# EAGLE schematic RASPILOTv1_0 (EAGLE 7.2.0)

## Sheet 1 of 8
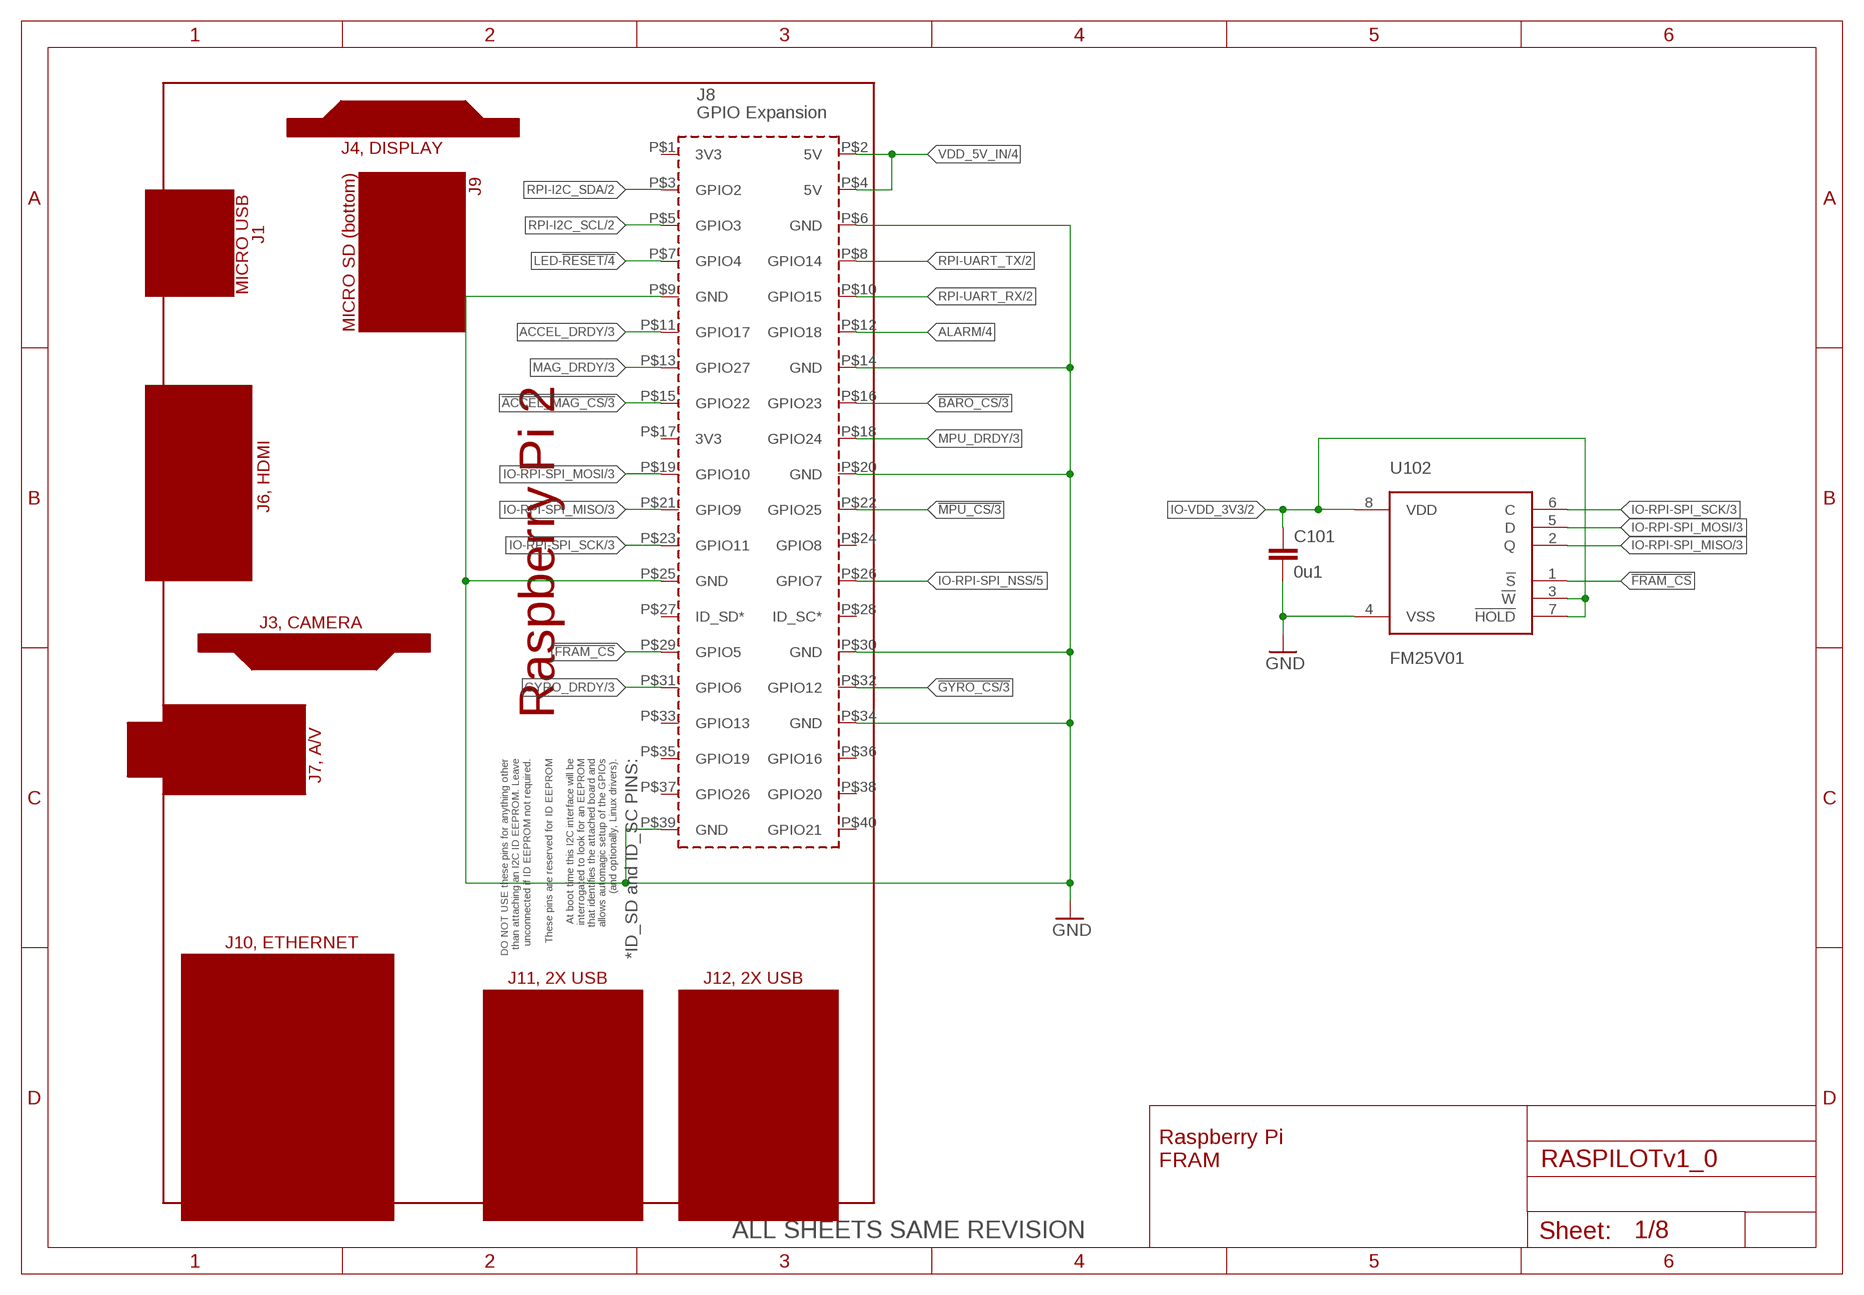
[diagram p0: schematic, sheet 1]

### Parts
C101  0u1  CAP0402  [0402-CAP]
U101  RPI2  [RPI2]
U102  FM25V01  [SO08]

### Nets
!ACCEL_MAG_CS: U101.P$15(GPIO22) ; also sheet 3
!BARO_CS: U101.P$16(GPIO23) ; also sheet 3
!FRAM_CS: U101.P$29(GPIO5) U102.1(!S)
!GYRO_CS: U101.P$32(GPIO12) ; also sheet 3
!MPU_CS: U101.P$22(GPIO25) ; also sheet 3
ACCEL_DRDY: U101.P$11(GPIO17) ; also sheet 3
ALARM: U101.P$12(GPIO18) ; also sheet 4
GND [power]: C101.P$2 U101.P$6(GND) U101.P$9(GND) U101.P$14(GND) U101.P$20(GND) U101.P$25(GND) U101.P$30(GND) U101.P$34(GND) U101.P$39(GND) U102.4(VSS) ; also sheet 2,3,4,5,6,7,8
GYRO_DRDY: U101.P$31(GPIO6) ; also sheet 3
IO-RPI-SPI_MISO: U101.P$21(GPIO9) U102.2(Q) ; also sheet 3,5
IO-RPI-SPI_MOSI: U101.P$19(GPIO10) U102.5(D) ; also sheet 3,5
IO-RPI-SPI_NSS: U101.P$26(GPIO7) ; also sheet 5
IO-RPI-SPI_SCK: U101.P$23(GPIO11) U102.6(C) ; also sheet 3,5
IO-VDD_3V3 [power]: C101.P$1 U102.3(!W) U102.7(!HOLD) U102.8(VDD) ; also sheet 2,4,5,6,7
LED-!RESET: U101.P$7(GPIO4) ; also sheet 4
MAG_DRDY: U101.P$13(GPIO27) ; also sheet 3
MPU_DRDY [power]: U101.P$18(GPIO24) ; also sheet 3
RPI-I2C_SCL: U101.P$5(GPIO3) ; also sheet 2,4
RPI-I2C_SDA: U101.P$3(GPIO2) ; also sheet 2,4
RPI-UART_RX: U101.P$10(GPIO15) ; also sheet 2
RPI-UART_TX: U101.P$8(GPIO14) ; also sheet 2
VDD_5V_IN [power]: U101.P$2(5V) U101.P$4(5V) ; also sheet 4,7,8
Unconnected: U101.P$1(3V3) U101.P$17(3V3) U101.P$24(GPIO8) U101.P$27(ID_SD*) U101.P$28(ID_SC*) U101.P$33(GPIO13) U101.P$35(GPIO19) U101.P$36(GPIO16) U101.P$37(GPIO26) U101.P$38(GPIO20) U101.P$40(GPIO21)

### Notes on the sheet
- Raspberry Pi
  FRAM
- ALL SHEETS SAME REVISION

## Sheet 2 of 8
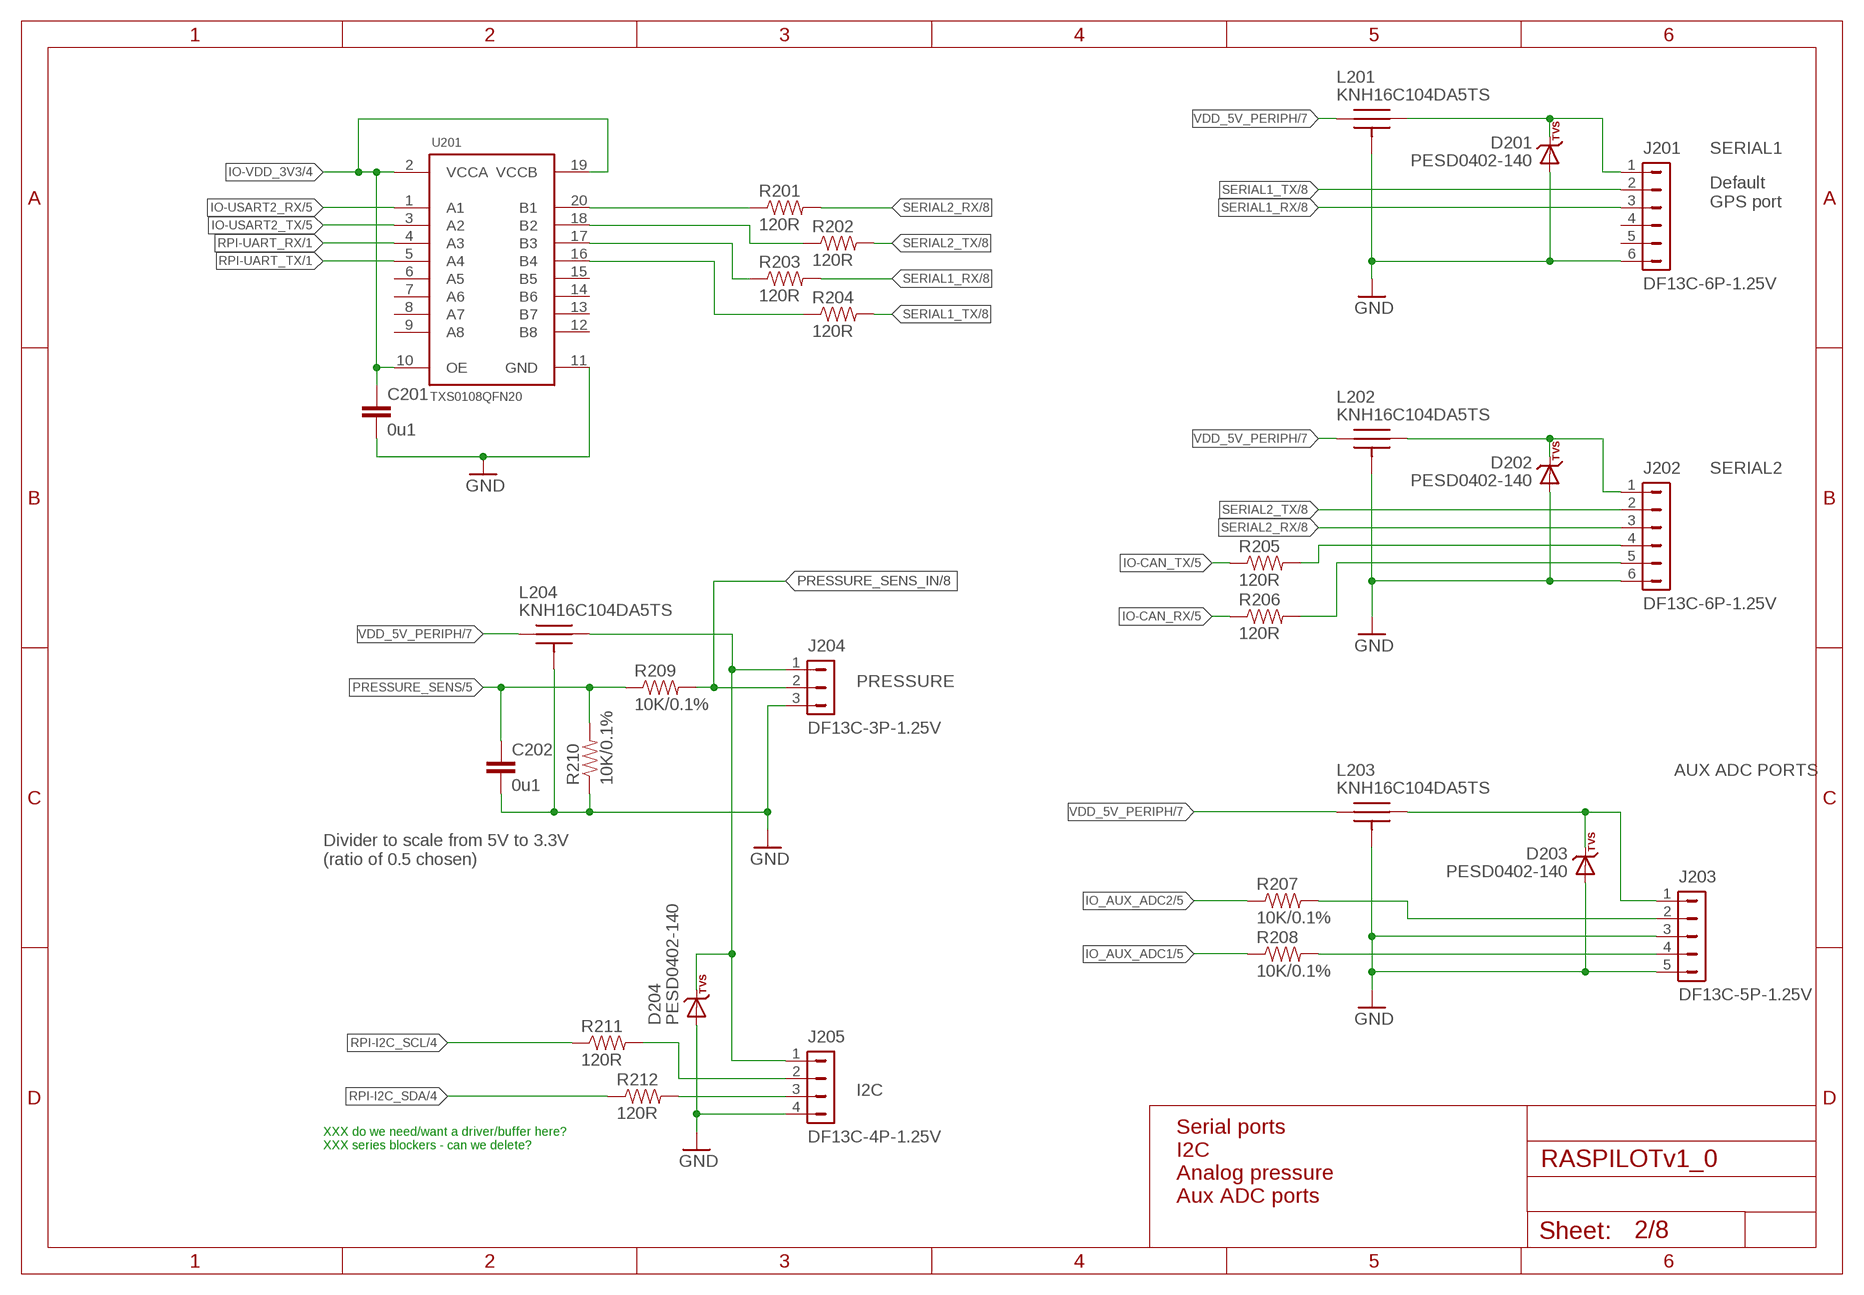
[diagram p1: schematic, sheet 2]

### Parts
C201  0u1  CAP0402  [0402-CAP]
C202  0u1  CAP0402  [0402-CAP]
D201  PESD0402-140  DIODE-TVS  [0402-TVS]
D202  PESD0402-140  DIODE-TVS  [0402-TVS]
D203  PESD0402-140  DIODE-TVS  [0402-TVS]
D204  PESD0402-140  DIODE-TVS  [0402-TVS]
J201  DF13C-6P-1.25V  DF13-6P-1.25V  [DF13C-6P-1.25V]
J202  DF13C-6P-1.25V  DF13-6P-1.25V  [DF13C-6P-1.25V]
J203  DF13C-5P-1.25V  DF13-5P-1.25V  [DF13C-5P-1.25V]
J204  DF13C-3P-1.25V  DF13-3P-1.25V  [DF13C-3P-1.25V]
J205  DF13C-4P-1.25V  DF13-4P-1.25V  [DF13C-4P-1.25V]
L201  KNH16C104DA5TS  [KYOCERA-KNH16-DA]
L202  KNH16C104DA5TS  [KYOCERA-KNH16-DA]
L203  KNH16C104DA5TS  [KYOCERA-KNH16-DA]
L204  KNH16C104DA5TS  [KYOCERA-KNH16-DA]
R201  120R  RESISTOR0402-RES  [0402-RES]
R202  120R  RESISTOR0402-RES  [0402-RES]
R203  120R  RESISTOR0402-RES  [0402-RES]
R204  120R  RESISTOR0402-RES  [0402-RES]
R205  120R  RESISTOR0402-RES  [0402-RES]
R206  120R  RESISTOR0402-RES  [0402-RES]
R207  10K/0.1%  RESISTOR0402-RES  [0402-RES]
R208  10K/0.1%  RESISTOR0402-RES  [0402-RES]
R209  10K/0.1%  RESISTOR0402-RES  [0402-RES]
R210  10K/0.1%  RESISTOR0402-RES  [0402-RES]
R211  120R  RESISTOR0402-RES  [0402-RES]
R212  120R  RESISTOR0402-RES  [0402-RES]
U201  TXS0108QFN20  [QFN20-RGY]

### Nets
FMU_AUX_ADC1_PROT1: J203.4 R208.P$2
FMU_AUX_ADC2_PROT1: J203.2 R207.P$2
GND [power]: C201.P$2 C202.P$2 D201.A D202.A D203.A D204.A J201.6 J202.6 J203.3 J203.5 J204.3 J205.4 L201.P$3 L201.P$4 L201.P$5 L202.P$3 L202.P$4 L202.P$5 L203.P$3 L203.P$4 L203.P$5 L204.P$3 L204.P$4 L204.P$5 R210.P$1 U201.11(GND) ; also sheet 1,3,4,5,6,7,8
IO-CAN_RX: R206.P$1 ; also sheet 5,8
IO-CAN_TX: R205.P$1 ; also sheet 5,8
IO-USART2_RX: U201.1(A1) ; also sheet 5
IO-USART2_TX: U201.3(A2) ; also sheet 5
IO-VDD_3V3 [power]: C201.P$1 U201.2(VCCA) U201.10(OE) U201.19(VCCB) ; also sheet 1,4,5,6,7
IO_AUX_ADC1: R208.P$1 ; also sheet 5
IO_AUX_ADC2: R207.P$1 ; also sheet 5
N$4 [power]: D203.C J203.1 L203.P$2
N$5 [power]: D201.C J201.1 L201.P$2
N$7: J205.2 R211.P$2
N$8: J205.3 R212.P$2
N$11 [power]: D204.C J204.1 J205.1 L204.P$2
N$14: J202.4 R205.P$2
N$19: J202.5 R206.P$2
N$70: R201.P$1 U201.20(B1)
N$82: R202.P$1 U201.18(B2)
N$83: R203.P$1 U201.17(B3)
N$84: R204.P$1 U201.16(B4)
N$100 [power]: D202.C J202.1 L202.P$2
PRESSURE_SENS: C202.P$1 R209.P$1 R210.P$2 ; also sheet 5
PRESSURE_SENS_IN: J204.2 R209.P$2 ; also sheet 8
RPI-I2C_SCL: R211.P$1 ; also sheet 1,4
RPI-I2C_SDA: R212.P$1 ; also sheet 1,4
RPI-UART_RX: U201.4(A3) ; also sheet 1
RPI-UART_TX: U201.5(A4) ; also sheet 1
SERIAL1_RX: J201.3 R203.P$2 ; also sheet 8
SERIAL1_TX: J201.2 R204.P$2 ; also sheet 8
SERIAL2_RX: J202.3 R201.P$2 ; also sheet 8
SERIAL2_TX: J202.2 R202.P$2 ; also sheet 8
VDD_5V_PERIPH [power]: L201.P$1 L202.P$1 L203.P$1 L204.P$1 ; also sheet 7
Unconnected: J201.4 J201.5 U201.6(A5) U201.7(A6) U201.8(A7) U201.9(A8) U201.12(B8) U201.13(B7) U201.14(B6) U201.15(B5)

### Notes on the sheet
- SERIAL1
- Default 
  GPS port
- SERIAL2
- PRESSURE
- AUX ADC PORTS
- Divider to scale from 5V to 3.3V
  (ratio of 0.5 chosen)
- I2C
- XXX do we need/want a driver/buffer here?
  XXX series blockers - can we delete?
- Serial ports
  I2C
  Analog pressure
  Aux ADC ports

## Sheet 3 of 8
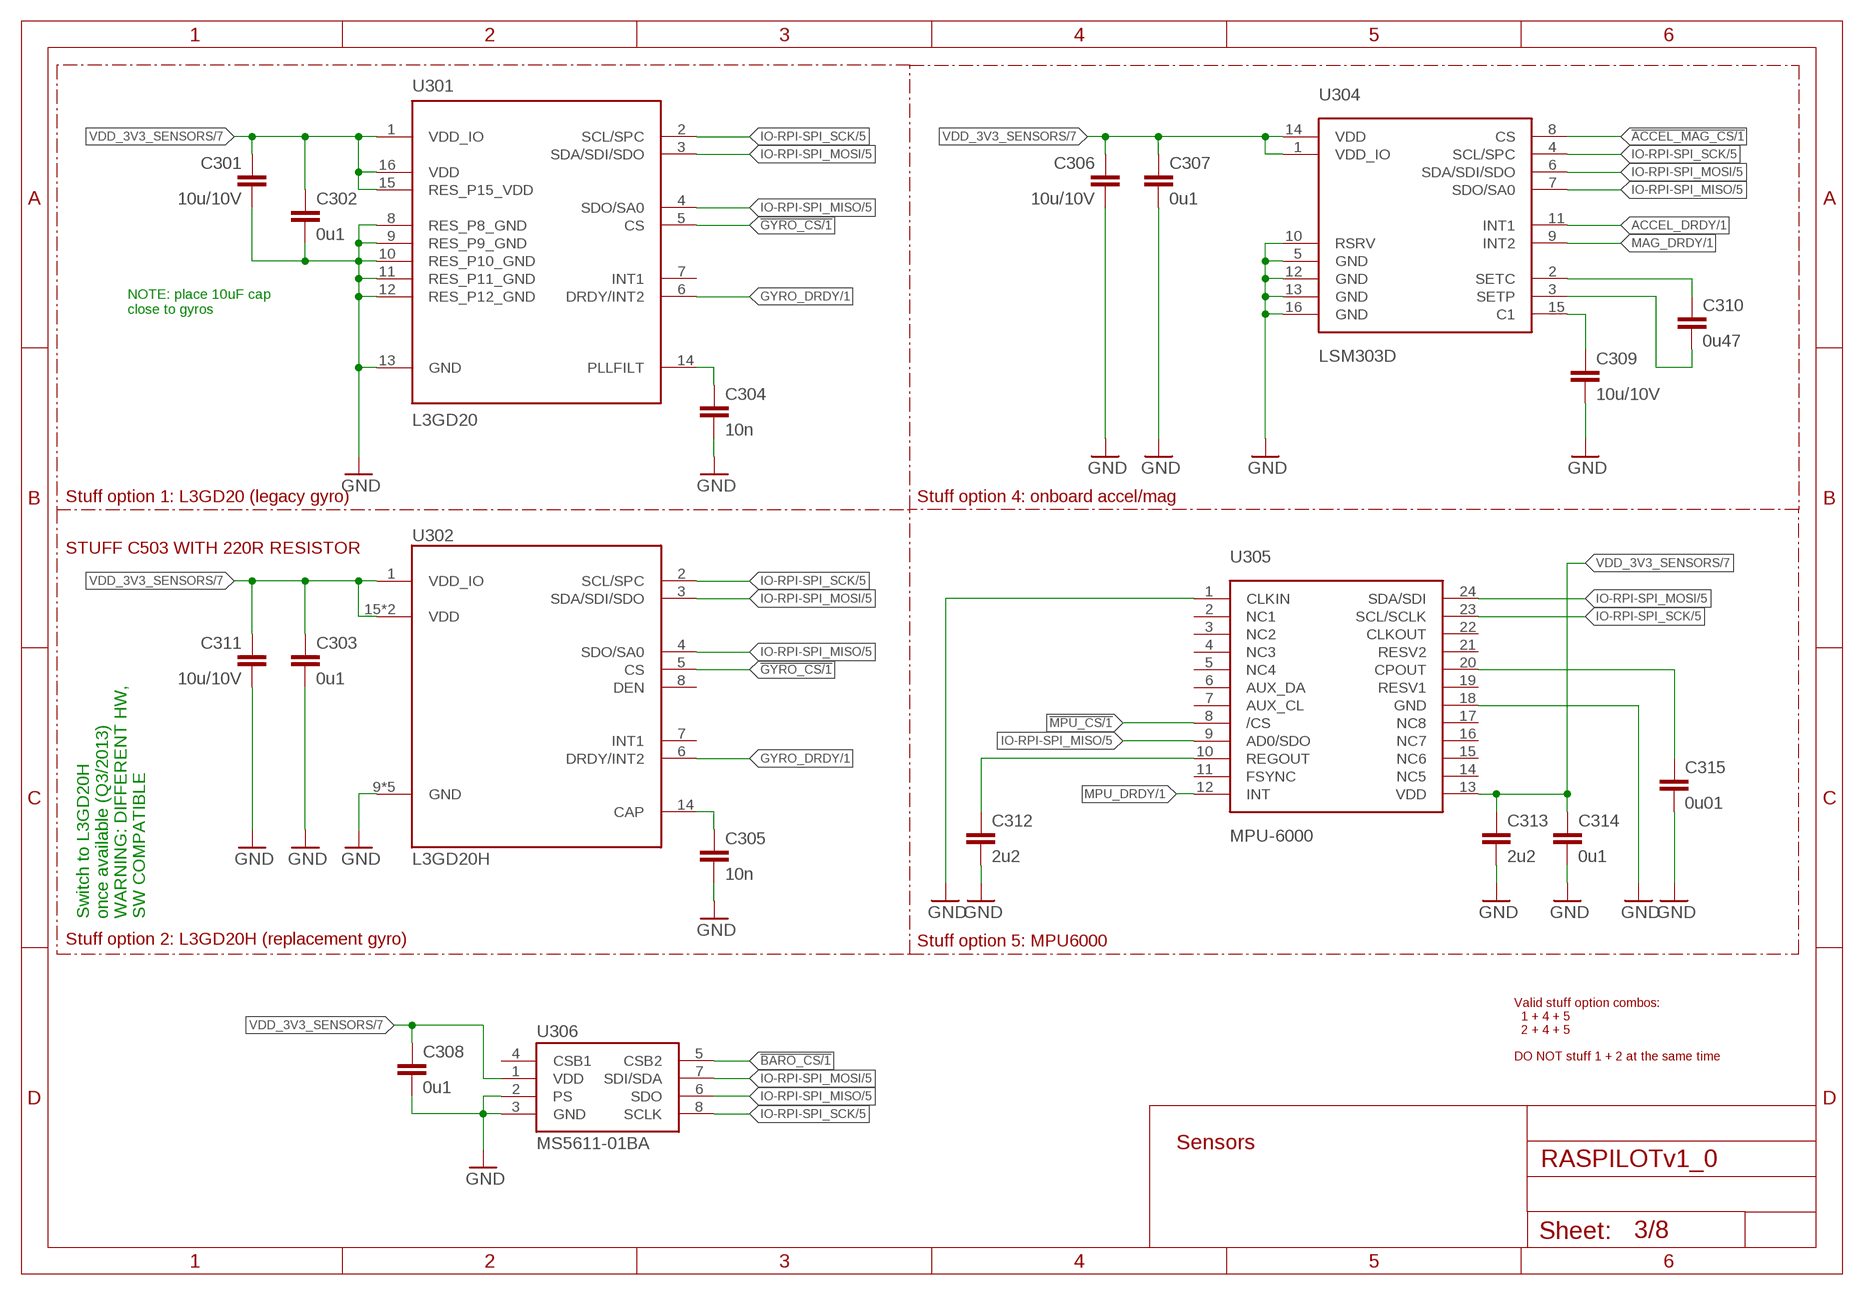
[diagram p2: schematic, sheet 3]

### Parts
C301  10u/10V  CAP0805  [0805-CAP]
C302  0u1  CAP0402  [0402-CAP]
C303  0u1  CAP0402  [0402-CAP]
C304  10n  CAP0402  [0402-CAP]
C305  10n  CAP0402  [0402-CAP]
C306  10u/10V  CAP0805  [0805-CAP]
C307  0u1  CAP0402  [0402-CAP]
C308  0u1  CAP0402  [0402-CAP]
C309  10u/10V  CAP0805  [0805-CAP]
C310  0u47  CAP0402  [0402-CAP]
C311  10u/10V  CAP0805  [0805-CAP]
C312  2u2  CAP0603  [0603-CAP]
C313  2u2  CAP0603  [0603-CAP]
C314  0u1  CAP0402  [0402-CAP]
C315  0u01  CAP0603  [0603-CAP]
U301  L3GD20  L3G4200DH-LL  [L3G4200DH-MAN]
U302  L3GD20H  [LGA-16L]
U304  LSM303D  [LGA-16L]
U305  MPU-6000  [QFN-24]
U306  MS5611-01BA  [MS5611-01BA]

### Nets
!ACCEL_MAG_CS: U304.8(CS) ; also sheet 1
!BARO_CS: U306.5(CSB2) ; also sheet 1
!GYRO_CS: U301.5(CS) U302.5(CS) ; also sheet 1
!MPU_CS: U305.8(/CS) ; also sheet 1
ACCEL_DRDY: U304.11(INT1) ; also sheet 1
GND [power]: C301.P$2 C302.P$2 C303.P$2 C304.P$2 C305.P$2 C306.P$2 C307.P$2 C308.P$2 C309.P$2 C311.P$2 C312.P$2 C313.P$2 C314.P$2 C315.P$2 U301.8(RES_P8_GND) U301.9(RES_P9_GND) U301.10(RES_P10_GND) U301.11(RES_P11_GND) U301.12(RES_P12_GND) U301.13(GND) U302.9(GND) U302.10(GND) U302.11(GND) U302.12(GND) U302.13(GND) U304.5(GND) U304.10(RSRV) U304.12(GND) U304.13(GND) U304.16(GND) U305.1(CLKIN) U305.18(GND) U306.2(PS) U306.3(GND) ; also sheet 1,2,4,5,6,7,8
GYRO_DRDY: U301.6(DRDY/INT2) U302.6(DRDY/INT2) ; also sheet 1
IO-RPI-SPI_MISO: U301.4(SDO/SA0) U302.4(SDO/SA0) U304.7(SDO/SA0) U305.9(AD0/SDO) U306.6(SDO) ; also sheet 1,5
IO-RPI-SPI_MOSI: U301.3(SDA/SDI/SDO) U302.3(SDA/SDI/SDO) U304.6(SDA/SDI/SDO) U305.24(SDA/SDI) U306.7(SDI/SDA) ; also sheet 1,5
IO-RPI-SPI_SCK: U301.2(SCL/SPC) U302.2(SCL/SPC) U304.4(SCL/SPC) U305.23(SCL/SCLK) U306.8(SCLK) ; also sheet 1,5
MAG_DRDY: U304.9(INT2) ; also sheet 1
MPU_DRDY [power]: U305.12(INT) ; also sheet 1
N$6: C309.P$1 U304.15(C1)
N$10: C310.P$1 U304.2(SETC)
N$17: C310.P$2 U304.3(SETP)
N$30: C305.P$1 U302.14(CAP)
N$35: C304.P$1 U301.14(PLLFILT)
N$50: C312.P$1 U305.10(REGOUT)
N$51: C315.P$1 U305.20(CPOUT)
VDD_3V3_SENSORS [power]: C301.P$1 C302.P$1 C303.P$1 C306.P$1 C307.P$1 C308.P$1 C311.P$1 C313.P$1 C314.P$1 U301.1(VDD_IO) U301.15(RES_P15_VDD) U301.16(VDD) U302.1(VDD_IO) U302.15(VDD) U302.16(VDD) U304.1(VDD_IO) U304.14(VDD) U305.13(VDD) U306.1(VDD) ; also sheet 7
Unconnected: U301.7(INT1) U302.7(INT1) U302.8(DEN) U305.2(NC1) U305.3(NC2) U305.4(NC3) U305.5(NC4) U305.6(AUX_DA) U305.7(AUX_CL) U305.11(FSYNC) U305.14(NC5) U305.15(NC6) U305.16(NC7) U305.17(NC8) U305.19(RESV1) U305.21(RESV2) U305.22(CLKOUT) U306.4(CSB1)

### Notes on the sheet
- NOTE: place 10uF cap
  close to gyros
- Stuff option 1: L3GD20 (legacy gyro) | Stuff option 4: onboard accel/mag
- STUFF C503 WITH 220R RESISTOR
- Switch to L3GD20H
  once available (Q3/2013)
  WARNING: DIFFERENT HW,
  SW COMPATIBLE
- Stuff option 2: L3GD20H (replacement gyro) | Stuff option 5: MPU6000
- Valid stuff option combos:
    1 + 4 + 5
    2 + 4 + 5
  
  DO NOT stuff 1 + 2 at the same time
- Sensors

## Sheet 4 of 8
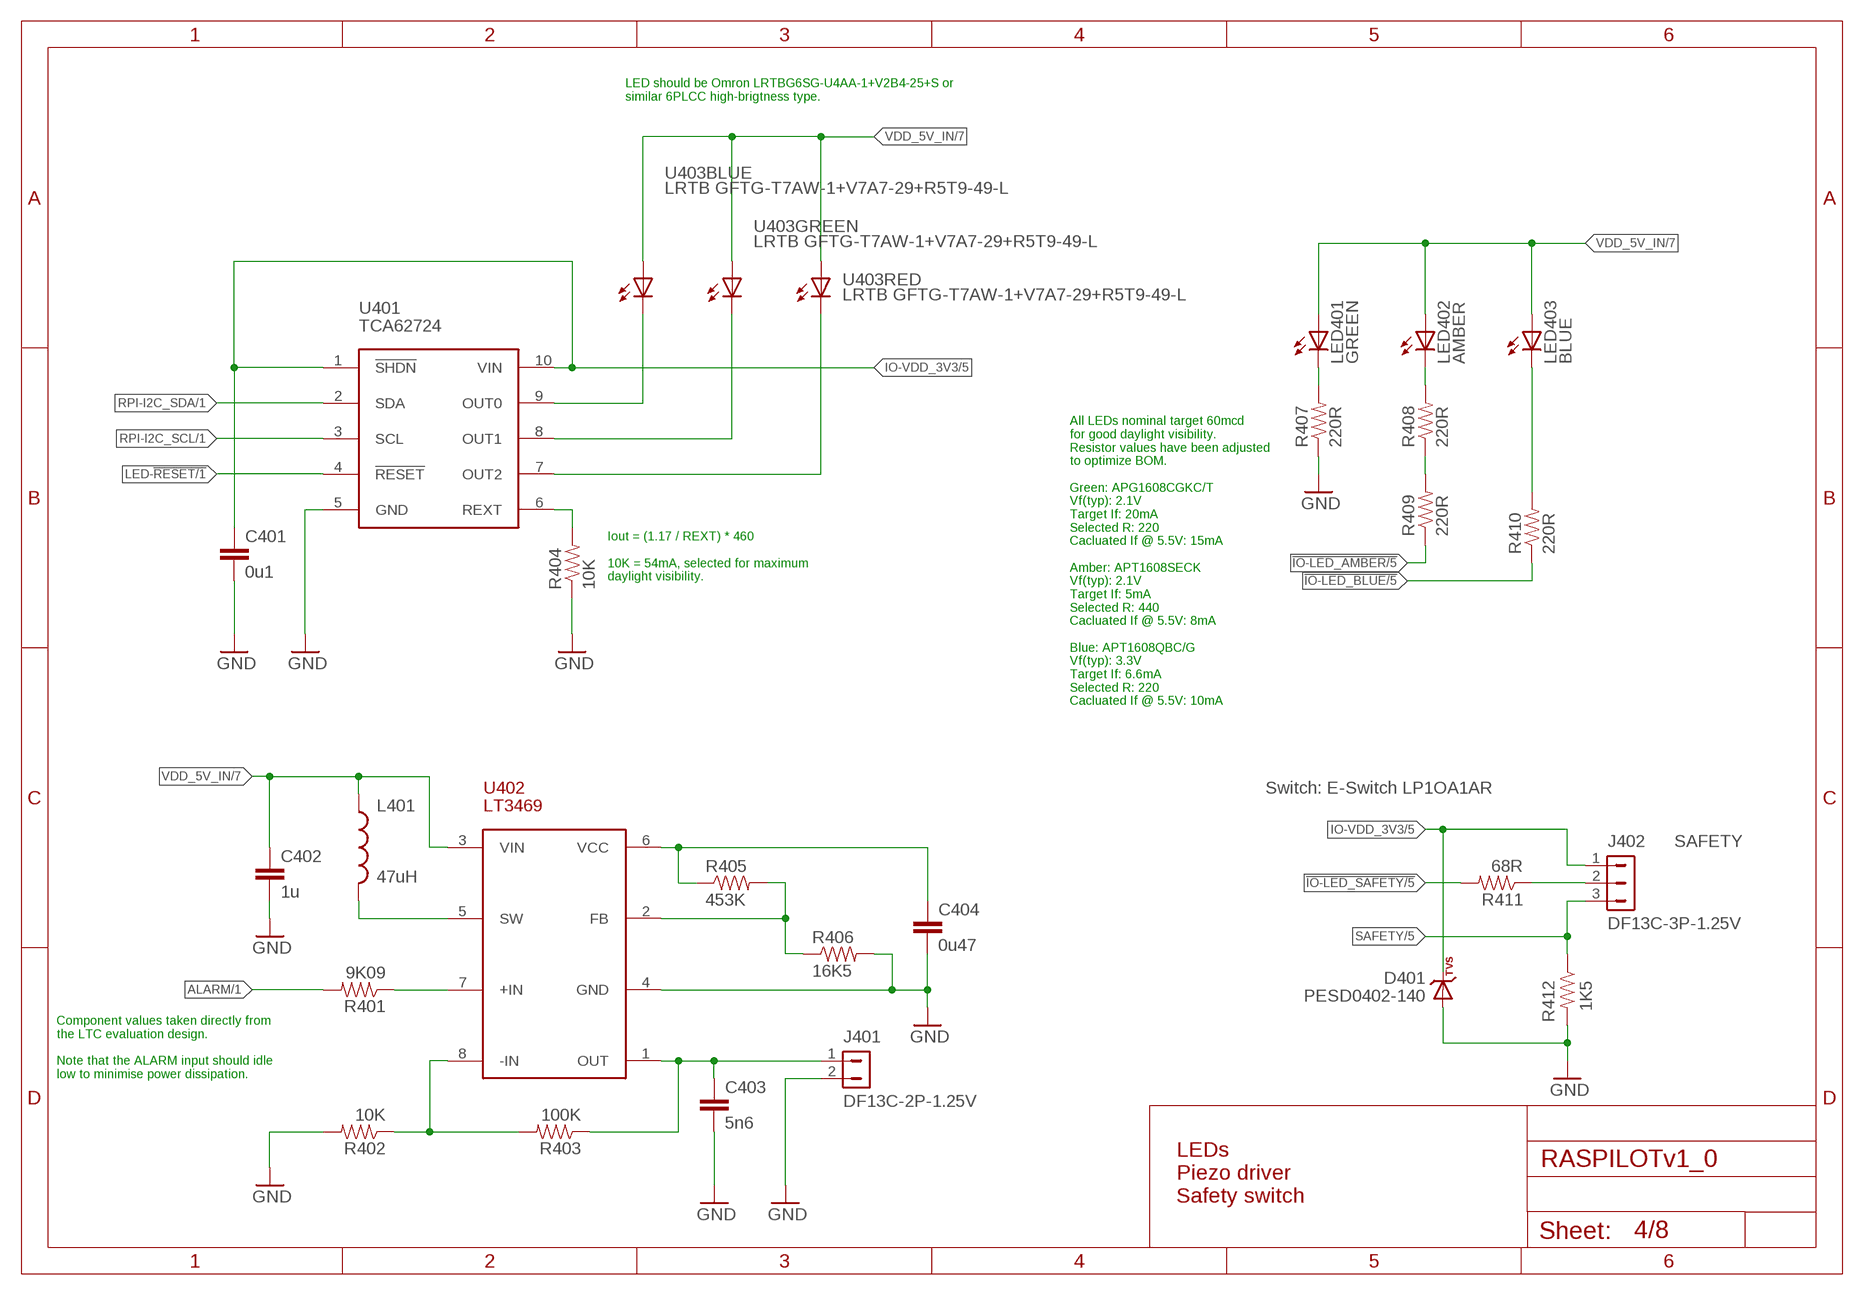
[diagram p3: schematic, sheet 4]

### Parts
C401  0u1  CAP0402  [0402-CAP]
C402  1u  CAP0603  [0603-CAP]
C403  5n6  CAP0402  [0402-CAP]
C404  0u47  CAP0402  [0402-CAP]
D401  PESD0402-140  DIODE-TVS  [0402-TVS]
J401  DF13C-2P-1.25V  DF13-2P-1.25V  [DF13C-2P-1.25V]
J402  DF13C-3P-1.25V  DF13-3P-1.25V  [DF13C-3P-1.25V]
L401  47uH  INDUCTOR0805  [0805-IND]
LED401  GREEN  LED0603  [0603-LED]
LED402  AMBER  LED0603  [0603-LED]
LED403  BLUE  LED0603  [0603-LED]
R401  9K09  RESISTOR0402-RES  [0402-RES]
R402  10K  RESISTOR0402-RES  [0402-RES]
R403  100K  RESISTOR0402-RES  [0402-RES]
R404  10K  RESISTOR0402-RES  [0402-RES]
R405  453K  RESISTOR0402-RES  [0402-RES]
R406  16K5  RESISTOR0402-RES  [0402-RES]
R407  220R  RESISTOR0402-RES  [0402-RES]
R408  220R  RESISTOR0402-RES  [0402-RES]
R409  220R  RESISTOR0402-RES  [0402-RES]
R410  220R  RESISTOR0402-RES  [0402-RES]
R411  68R  RESISTOR0402-RES  [0402-RES]
R412  1K5  RESISTOR0402-RES  [0402-RES]
U401  TCA62724FMG  [SON10]
U402  LT3469  [SOT23-8]
U403  LRTB GFTG-T7AW-1+V7A7-29+R5T9-49-L  RGB-LED6-PLCC  [6-PLCC]

### Nets
!IO-LED_AMBER: R409.P$1 ; also sheet 5
!IO-LED_BLUE: R410.P$1 ; also sheet 5
!IO-LED_SAFETY: R411.P$2 ; also sheet 5
ALARM: R401.P$2 ; also sheet 1
GND [power]: C401.P$2 C402.P$2 C403.P$2 C404.P$2 D401.A J401.2 R402.P$2 R404.P$1 R406.P$2 R407.P$1 R412.P$2 U401.5(GND) U402.4(GND) ; also sheet 1,2,3,5,6,7,8
IO-VDD_3V3 [power]: C401.P$1 D401.C J402.1 U401.1(!SHDN) U401.10(VIN) ; also sheet 1,2,5,6,7
LED-!RESET: U401.4(!RESET) ; also sheet 1
N$9: LED403.C R410.P$2
N$24: R405.P$2 R406.P$1 U402.2(FB)
N$25: R402.P$1 R403.P$2 U402.8(-IN)
N$27: C403.P$1 J401.1 R403.P$1 U402.1(OUT)
N$28: R401.P$1 U402.7(+IN)
N$29: LED401.C R407.P$2
N$32: L401.P$2 U402.5(SW)
N$36: C404.P$1 R405.P$1 U402.6(VCC)
N$39: R408.P$1 R409.P$2
N$40: LED402.C R408.P$2
N$57: J402.2 R411.P$1
N$95: R404.P$2 U401.6(REXT)
RGB_LED_3: U401.9(OUT0) U403.C1(BLUE:C)
RGB_LED_4: U401.8(OUT1) U403.C2(GREEN:C)
RGB_LED_14: U401.7(OUT2) U403.C3(RED:C)
RPI-I2C_SCL: U401.3(SCL) ; also sheet 1,2
RPI-I2C_SDA: U401.2(SDA) ; also sheet 1,2
SAFETY: J402.3 R412.P$1 ; also sheet 5
VDD_5V_IN [power]: C402.P$1 L401.P$1 LED401.A LED402.A LED403.A U402.3(VIN) U403.A1(BLUE:A) U403.A2(GREEN:A) U403.A3(RED:A) ; also sheet 1,7,8

### Notes on the sheet
- LED should be Omron LRTBG6SG-U4AA-1+V2B4-25+S or 
  similar 6PLCC high-brigtness type.
- Iout = (1.17 / REXT) * 460
  
  10K = 54mA, selected for maximum
  daylight visibility.
- All LEDs nominal target 60mcd
  for good daylight visibility.
  Resistor values have been adjusted
  to optimize BOM.
  
  Green: APG1608CGKC/T
  Vf(typ): 2.1V
  Target If: 20mA
  Selected R: 220
  Cacluated If @ 5.5V: 15mA
  
  Amber: APT1608SECK
  Vf(typ): 2.1V
  Target If: 5mA
  Selected R: 440
  Cacluated If @ 5.5V: 8mA
  
  Blue: APT1608QBC/G
  Vf(typ): 3.3V
  Target If: 6.6mA
  Selected R: 220
  Cacluated If @ 5.5V: 10mA
- Switch: E-Switch LP1OA1AR
- SAFETY
- Component values taken directly from
  the LTC evaluation design.
  
  Note that the ALARM input should idle
  low to minimise power dissipation.
- LEDs
  Piezo driver
  Safety switch

## Sheet 5 of 8
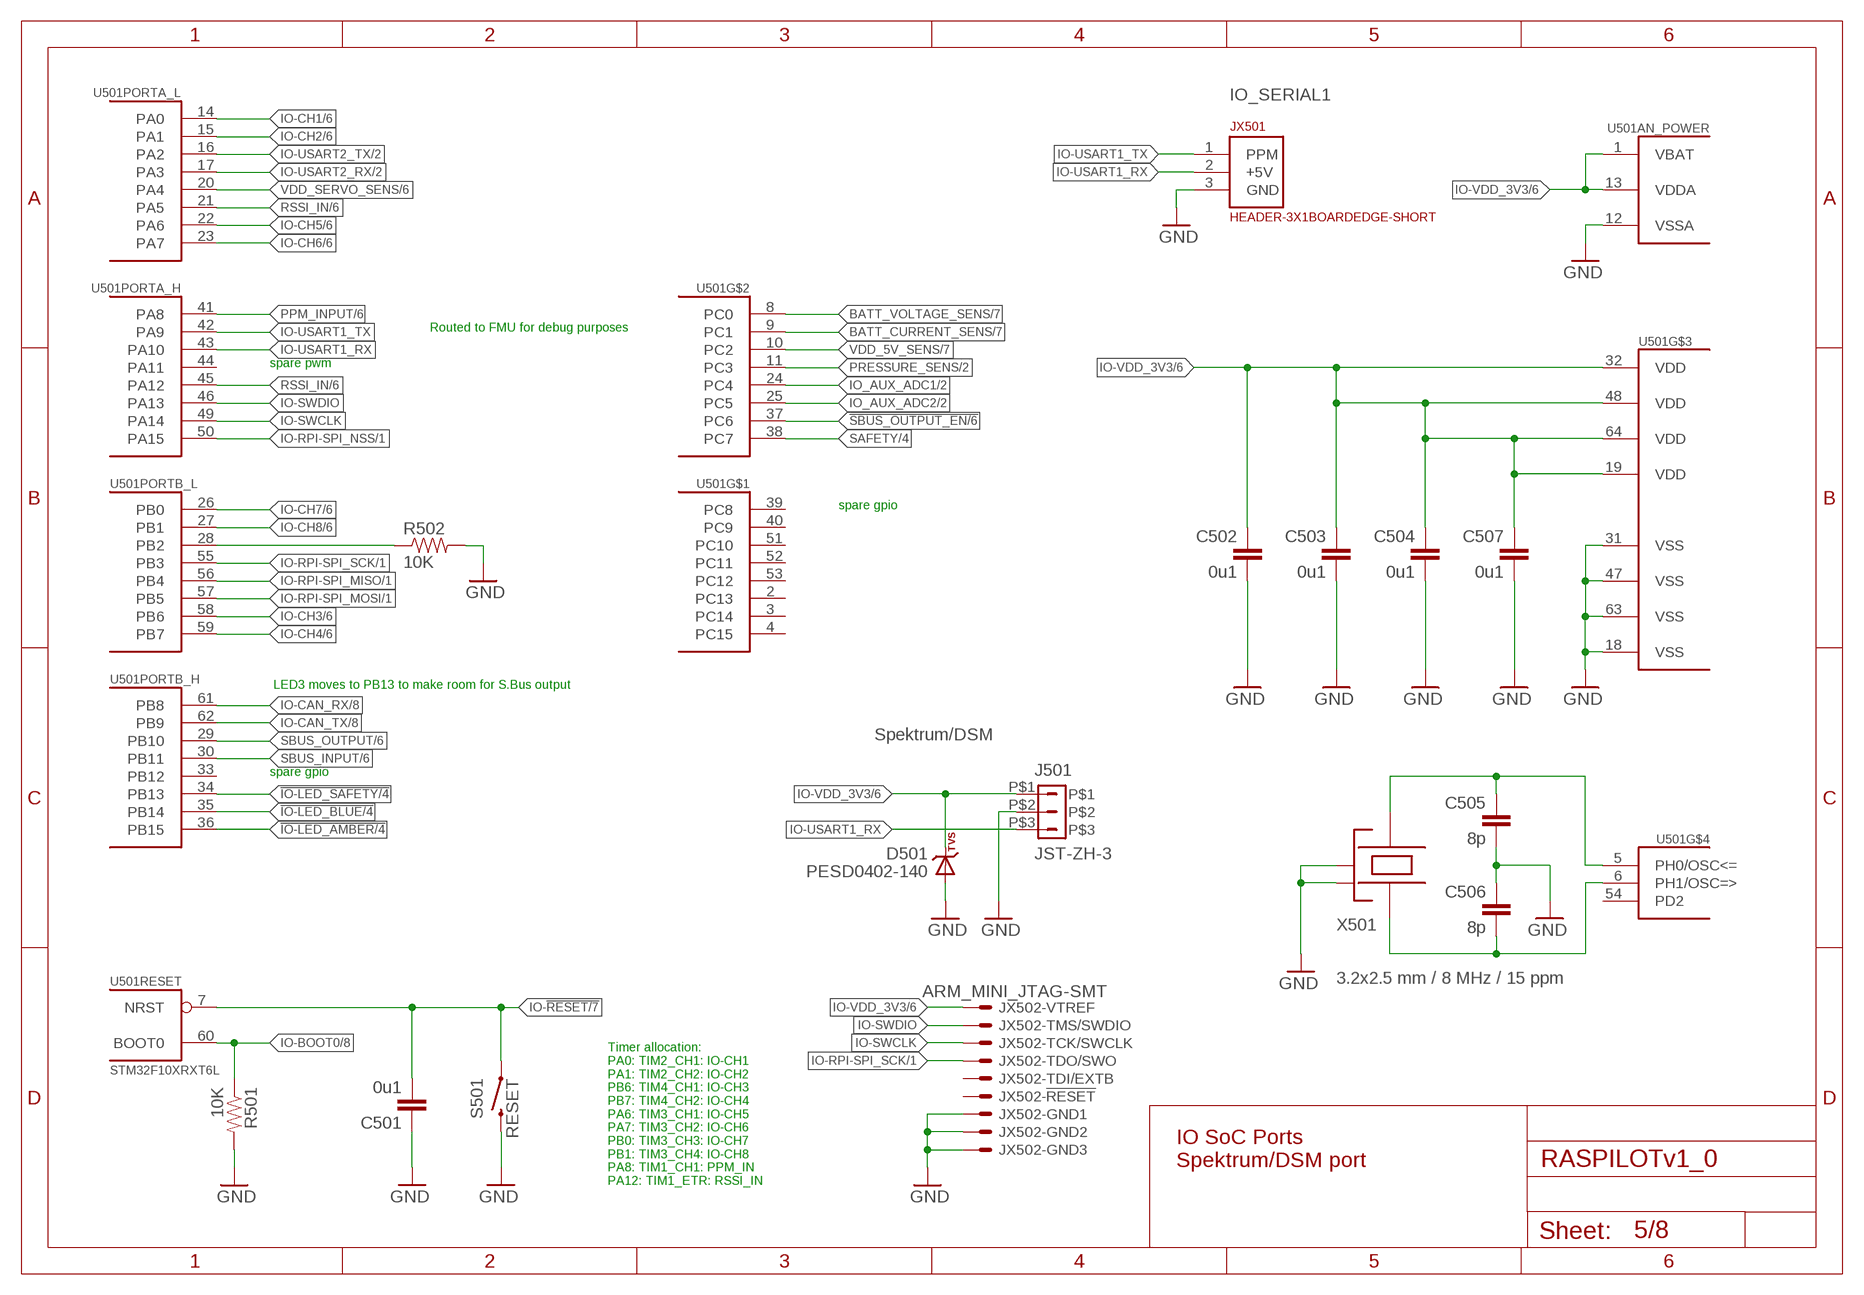
[diagram p4: schematic, sheet 5]

### Parts
C501  0u1  CAP0402  [0402-CAP]
C502  0u1  CAP0402  [0402-CAP]
C503  0u1  CAP0402  [0402-CAP]
C504  0u1  CAP0402  [0402-CAP]
C505  8p  CAP0402  [0402-CAP]
C506  8p  CAP0402  [0402-CAP]
C507  0u1  CAP0402  [0402-CAP]
D501  PESD0402-140  DIODE-TVS  [0402-TVS]
J501  JST-ZH-3  [JST-ZH-SMT-VERTICAL]
JX501  HEADER-3X1BOARDEDGE-SHORT  [HEADER_3X01_SMD_H_BOARD_EDGE_SHORT]
JX502  ARM_MINI_JTAG-SMT  [FTSH-105-01-XXX-DV-K]
R501  10K  RESISTOR0402-RES  [0402-RES]
R502  10K  RESISTOR0402-RES  [0402-RES]
S501  RESET  SWITCH-MOMENTARY-2  [EVQP7J01K]
U501  STM32F10XRXT6L  [TQFP64]
X501  3.2x2.5 mm / 8 MHz / 15 ppm  OSCILLATOR-3.2X2.5  [OSCILLATOR-3.2X2.5]

### Nets
!IO-LED_AMBER: U501.36(PORTB_H:PB15) ; also sheet 4
!IO-LED_BLUE: U501.35(PORTB_H:PB14) ; also sheet 4
!IO-LED_SAFETY: U501.34(PORTB_H:PB13) ; also sheet 4
!SBUS_OUTPUT_EN: U501.37(PC6) ; also sheet 6
BATT_CURRENT_SENS: U501.9(PC1) ; also sheet 7
BATT_VOLTAGE_SENS: U501.8(PC0) ; also sheet 7
GND [power]: C501.P$1 C502.P$2 C503.P$2 C504.P$2 C505.P$2 C506.P$1 C507.P$2 D501.A J501.P$2 JX501.3(GND) JX502.3 JX502.5 JX502.9 R501.P$2 R502.P$2 S501.B3 U501.12(AN_POWER:VSSA) U501.18(VSS) U501.31(VSS) U501.47(VSS) U501.63(VSS) X501.2(NC_2) X501.4(NC_4) ; also sheet 1,2,3,4,6,7,8
IO-!RESET: C501.P$2 S501.A1 U501.7(RESET:NRST) ; also sheet 7
IO-BOOT0: R501.P$1 U501.60(RESET:BOOT0) ; also sheet 8
IO-BOOT1: R502.P$1 U501.28(PORTB_L:PB2)
IO-CAN_RX: U501.61(PORTB_H:PB8) ; also sheet 2,8
IO-CAN_TX: U501.62(PORTB_H:PB9) ; also sheet 2,8
IO-CH1: U501.14(PORTA_L:PA0) ; also sheet 6
IO-CH2: U501.15(PORTA_L:PA1) ; also sheet 6
IO-CH3: U501.58(PORTB_L:PB6) ; also sheet 6
IO-CH4: U501.59(PORTB_L:PB7) ; also sheet 6
IO-CH5: U501.22(PORTA_L:PA6) ; also sheet 6
IO-CH6: U501.23(PORTA_L:PA7) ; also sheet 6
IO-CH7: U501.26(PORTB_L:PB0) ; also sheet 6
IO-CH8: U501.27(PORTB_L:PB1) ; also sheet 6
IO-RPI-SPI_MISO: U501.56(PORTB_L:PB4) ; also sheet 1,3
IO-RPI-SPI_MOSI: U501.57(PORTB_L:PB5) ; also sheet 1,3
IO-RPI-SPI_NSS: U501.50(PORTA_H:PA15) ; also sheet 1
IO-RPI-SPI_SCK: JX502.6 U501.55(PORTB_L:PB3) ; also sheet 1,3
IO-SWCLK: JX502.4 U501.49(PORTA_H:PA14)
IO-SWDIO: JX502.2 U501.46(PORTA_H:PA13)
IO-USART1_RX: J501.P$3 JX501.2(+5V) U501.43(PORTA_H:PA10)
IO-USART1_TX: JX501.1(PPM) U501.42(PORTA_H:PA9)
IO-USART2_RX: U501.17(PORTA_L:PA3) ; also sheet 2
IO-USART2_TX: U501.16(PORTA_L:PA2) ; also sheet 2
IO-VDD_3V3 [power]: C502.P$1 C503.P$1 C504.P$1 C507.P$1 D501.C J501.P$1 JX502.1 U501.1(AN_POWER:VBAT) U501.13(AN_POWER:VDDA) U501.19(VDD) U501.32(VDD) U501.48(VDD) U501.64(VDD) ; also sheet 1,2,4,6,7
IO_AUX_ADC1: U501.24(PC4) ; also sheet 2
IO_AUX_ADC2: U501.25(PC5) ; also sheet 2
N$18: C506.P$2 U501.6(PH1/OSC=>) X501.1
N$22: C505.P$1 U501.5(PH0/OSC<=) X501.3
PPM_INPUT: U501.41(PORTA_H:PA8) ; also sheet 6
PRESSURE_SENS: U501.11(PC3) ; also sheet 2
RSSI_IN: U501.21(PORTA_L:PA5) U501.45(PORTA_H:PA12) ; also sheet 6
SAFETY: U501.38(PC7) ; also sheet 4
SBUS_INPUT: U501.30(PORTB_H:PB11) ; also sheet 6
SBUS_OUTPUT: U501.29(PORTB_H:PB10) ; also sheet 6
VDD_5V_SENS: U501.10(PC2) ; also sheet 7
VDD_SERVO_SENS: U501.20(PORTA_L:PA4) ; also sheet 6
Unconnected: JX502.8 JX502.10 U501.2(PC13) U501.3(PC14) U501.4(PC15) U501.33(PORTB_H:PB12) U501.39(PC8) U501.40(PC9) U501.44(PORTA_H:PA11) U501.51(PC10) U501.52(PC11) U501.53(PC12) U501.54(PD2)

### Notes on the sheet
- IO_SERIAL1
- Routed to FMU for debug purposes
- spare pwm
- spare gpio
- LED3 moves to PB13 to make room for S.Bus output
- Spektrum/DSM
- spare gpio
- IO SoC Ports
  Spektrum/DSM port
- Timer allocation:
  PA0: TIM2_CH1: IO-CH1
  PA1: TIM2_CH2: IO-CH2
  PB6: TIM4_CH1: IO-CH3
  PB7: TIM4_CH2: IO-CH4
  PA6: TIM3_CH1: IO-CH5
  PA7: TIM3_CH2: IO-CH6
  PB0: TIM3_CH3: IO-CH7
  PB1: TIM3_CH4: IO-CH8
  PA8: TIM1_CH1: PPM_IN
  PA12: TIM1_ETR: RSSI_IN

## Sheet 6 of 8
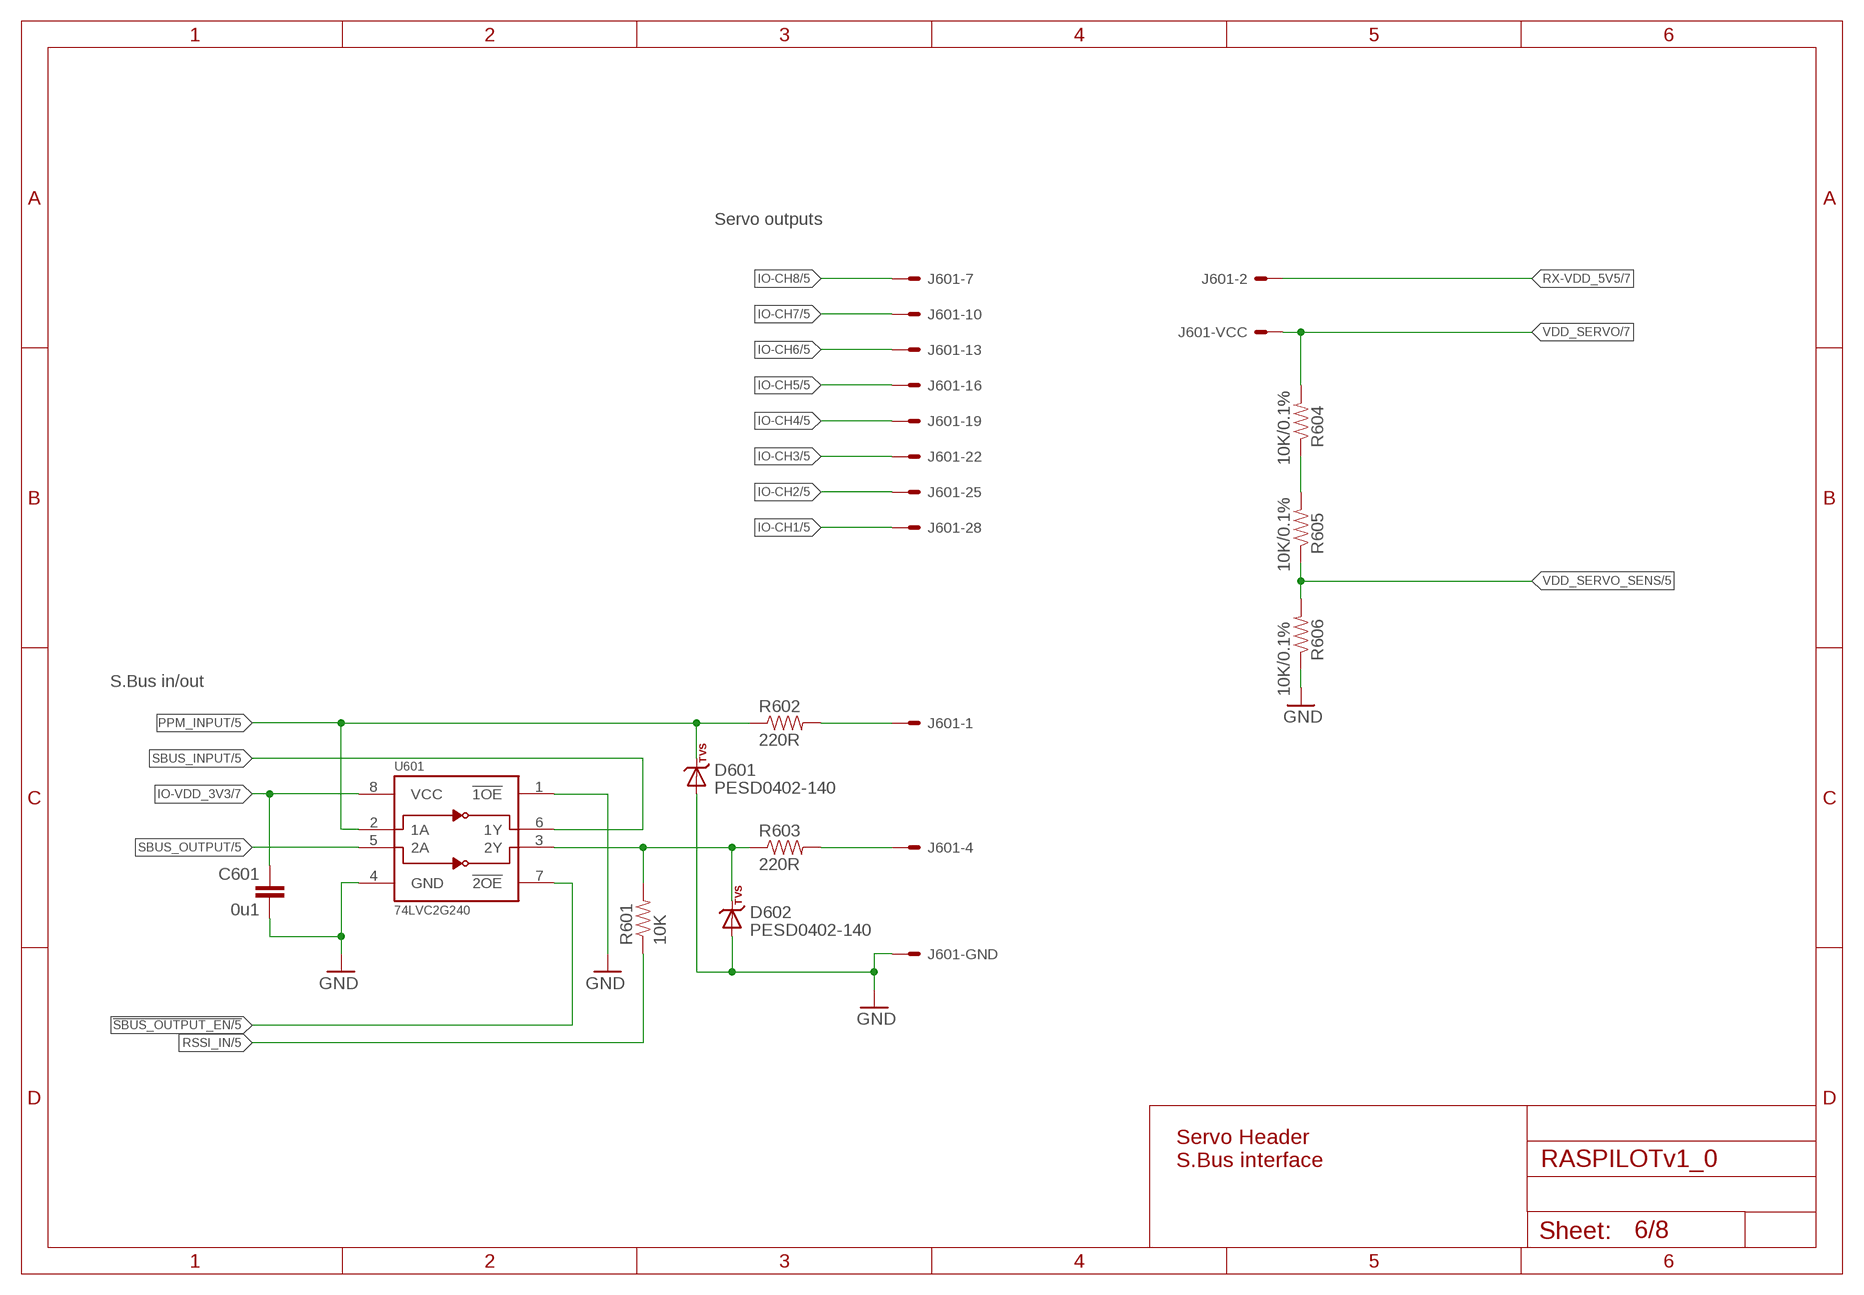
[diagram p5: schematic, sheet 6]

### Parts
C601  0u1  CAP0402  [0402-CAP]
D601  PESD0402-140  DIODE-TVS  [0402-TVS]
D602  PESD0402-140  DIODE-TVS  [0402-TVS]
J601  HEADER-3X10  [3X10RA]
R601  10K  RESISTOR0402-RES  [0402-RES]
R602  220R  RESISTOR0402-RES  [0402-RES]
R603  220R  RESISTOR0402-RES  [0402-RES]
R604  10K/0.1%  RESISTOR0402-RES  [0402-RES]
R605  10K/0.1%  RESISTOR0402-RES  [0402-RES]
R606  10K/0.1%  RESISTOR0402-RES  [0402-RES]
U601  74LVC2G240  74LVC2G240-TSSOP-8  [TSSOP8_SOT505-2]

### Nets
!SBUS_OUTPUT_EN: U601.7(!2OE) ; also sheet 5
GND [power]: C601.P$2 D601.A D602.A J601.3 J601.6 J601.9 J601.12 J601.15 J601.18 J601.21 J601.24 J601.27 J601.30 R606.P$1 U601.1(!1OE) U601.4(GND) ; also sheet 1,2,3,4,5,7,8
IO-CH1: J601.28 ; also sheet 5
IO-CH2: J601.25 ; also sheet 5
IO-CH3: J601.22 ; also sheet 5
IO-CH4: J601.19 ; also sheet 5
IO-CH5: J601.16 ; also sheet 5
IO-CH6: J601.13 ; also sheet 5
IO-CH7: J601.10 ; also sheet 5
IO-CH8: J601.7 ; also sheet 5
IO-VDD_3V3 [power]: C601.P$1 U601.8(VCC) ; also sheet 1,2,4,5,7
N$3: R604.P$1 R605.P$2
N$38: D602.C R601.P$2 R603.P$1 U601.3(2Y)
N$99: J601.4 R603.P$2
PPM-SBUS-PROT: J601.1 R602.P$2
PPM_INPUT: D601.C R602.P$1 U601.2(1A) ; also sheet 5
RSSI_IN: R601.P$1 ; also sheet 5
RX-VDD_5V5: J601.2 ; also sheet 7
SBUS_INPUT: U601.6(1Y) ; also sheet 5
SBUS_OUTPUT: U601.5(2A) ; also sheet 5
VDD_SERVO [power]: J601.5 J601.8 J601.11 J601.14 J601.17 J601.20 J601.23 J601.26 J601.29 R604.P$2 ; also sheet 7,8
VDD_SERVO_SENS: R605.P$1 R606.P$2 ; also sheet 5

### Notes on the sheet
- Servo outputs
- S.Bus in/out
- Servo Header
  S.Bus interface

## Sheet 7 of 8
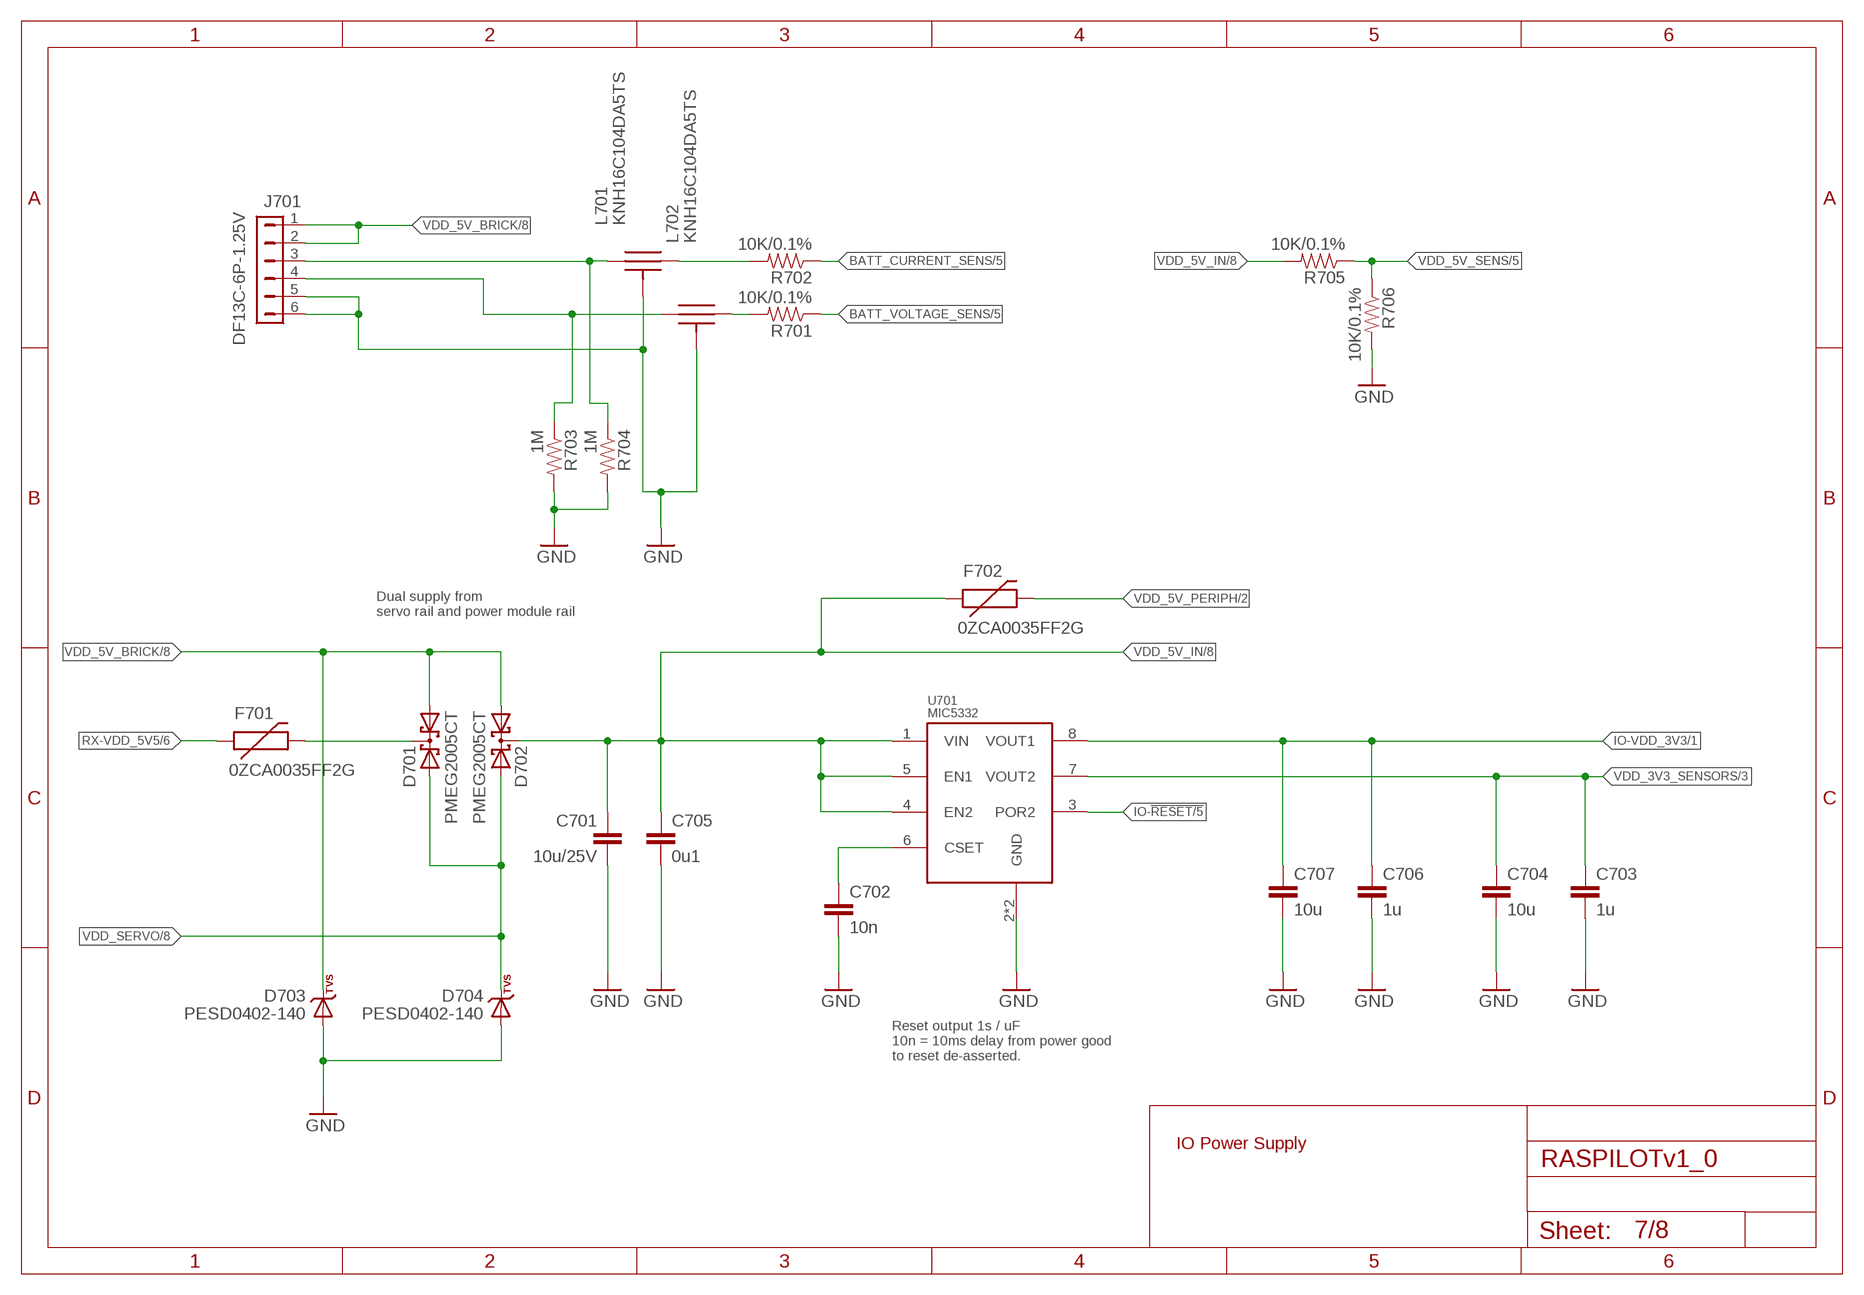
[diagram p6: schematic, sheet 7]

### Parts
C701  10u/25V  CAP0805  [0805-CAP]
C702  10n  CAP0402  [0402-CAP]
C703  1u  CAP0603  [0603-CAP]
C704  10u  CAP0603  [0603-CAP]
C705  0u1  CAP0402  [0402-CAP]
C706  1u  CAP0603  [0603-CAP]
C707  10u  CAP0603  [0603-CAP]
D701  PMEG2005CT  [SOT23-3]
D702  PMEG2005CT  [SOT23-3]
D703  PESD0402-140  DIODE-TVS  [0402-TVS]
D704  PESD0402-140  DIODE-TVS  [0402-TVS]
F701  0ZCA0035FF2G  PTCSMD  [PTC-1206]
F702  0ZCA0035FF2G  PTCSMD  [PTC-1206]
J701  DF13C-6P-1.25V  DF13-6P-1.25V  [DF13C-6P-1.25V]
L701  KNH16C104DA5TS  [KYOCERA-KNH16-DA]
L702  KNH16C104DA5TS  [KYOCERA-KNH16-DA]
R701  10K/0.1%  RESISTOR0402-RES  [0402-RES]
R702  10K/0.1%  RESISTOR0402-RES  [0402-RES]
R703  1M  RESISTOR0402-RES  [0402-RES]
R704  1M  RESISTOR0402-RES  [0402-RES]
R705  10K/0.1%  RESISTOR0402-RES  [0402-RES]
R706  10K/0.1%  RESISTOR0402-RES  [0402-RES]
U701  MIC5332  [MLF-8-EPAD]

### Nets
BATT_CURRENT_SENS: R702.P$1 ; also sheet 5
BATT_CURRENT_SENS_PROT1: J701.3 L701.P$1 R704.P$1
BATT_VOLTAGE_SENS: R701.P$1 ; also sheet 5
BATT_VOLTAGE_SENS_PROT1: J701.4 L702.P$1 R703.P$1
GND [power]: C701.P$2 C702.P$2 C703.P$2 C704.P$2 C705.P$2 C706.P$2 C707.P$2 D703.A D704.A J701.5 J701.6 L701.P$3 L701.P$4 L701.P$5 L702.P$3 L702.P$4 L702.P$5 R703.P$2 R704.P$2 R706.P$2 U701.2(GND) U701.GND ; also sheet 1,2,3,4,5,6,8
IO-!RESET: U701.3(POR2) ; also sheet 5
IO-VDD_3V3 [power]: C706.P$1 C707.P$1 U701.8(VOUT1) ; also sheet 1,2,4,5,6
N$1: L702.P$2 R701.P$2
N$2: L701.P$2 R702.P$2
N$46: D701.3(CC) F701.2
N$104: C702.P$1 U701.6(CSET)
RX-VDD_5V5: F701.1 ; also sheet 6
VDD_3V3_SENSORS [power]: C703.P$1 C704.P$1 U701.7(VOUT2) ; also sheet 3
VDD_5V_BRICK [power]: D701.1(A1) D702.1(A1) D703.C J701.1 J701.2 ; also sheet 8
VDD_5V_IN [power]: C701.P$1 C705.P$1 D702.3(CC) F702.1 R705.P$2 U701.1(VIN) U701.4(EN2) U701.5(EN1) ; also sheet 1,4,8
VDD_5V_PERIPH [power]: F702.2 ; also sheet 2
VDD_5V_SENS: R705.P$1 R706.P$1 ; also sheet 5
VDD_SERVO [power]: D701.2(A2) D702.2(A2) D704.C ; also sheet 6,8

### Notes on the sheet
- Dual supply from
  servo rail and power module rail
- Reset output 1s / uF
  10n = 10ms delay from power good
  to reset de-asserted.
- IO Power Supply

## Sheet 8 of 8
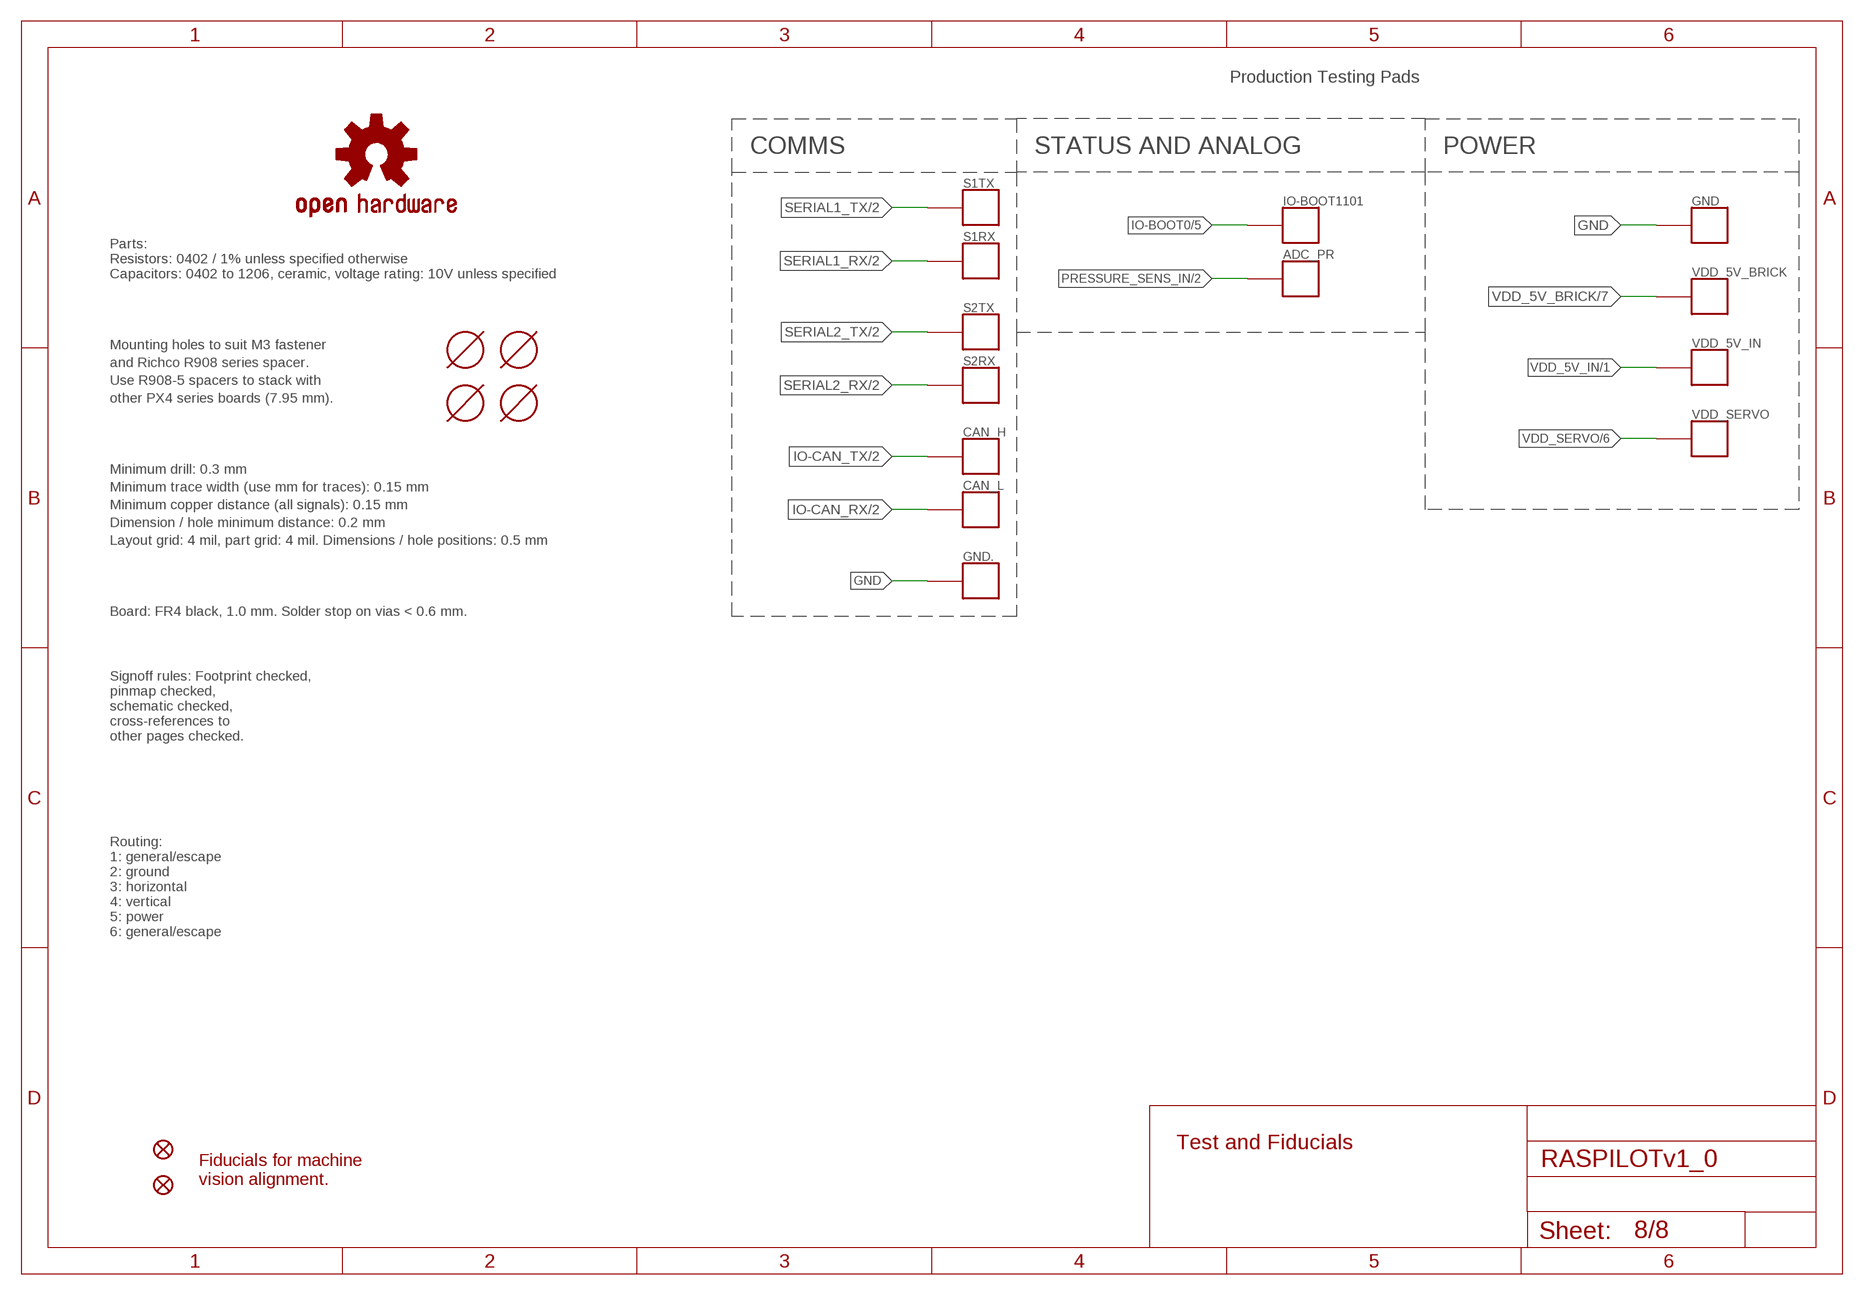
[diagram p7: schematic, sheet 8]

### Parts
ADC_PR  PAD.04  [PAD.04X.04]
CAN_H  PAD.04  [PAD.04X.04]
CAN_L  PAD.04  [PAD.04X.04]
GND  PAD.04  [PAD.04X.04]
GND.  PAD.04  [PAD.04X.04]
IO-BOOT1101  PAD.04  [PAD.04X.04]
JP1  FIDUCIAL1.5X3  [FIDUCIAL-1.5X3]
JP2  FIDUCIAL1.5X3  [FIDUCIAL-1.5X3]
M3_MOUNT1101  MOUNT-HOLE3.1MM  [MOUNT-HOLE3.1]
M3_MOUNT1102  MOUNT-HOLE3.1MM  [MOUNT-HOLE3.1]
M3_MOUNT1103  MOUNT-HOLE3.1MM  [MOUNT-HOLE3.1]
M3_MOUNT1104  MOUNT-HOLE3.1MM  [MOUNT-HOLE3.1]
OSHW_LOGO  OSHW-LOGOS  [OSHW-LOGO-S]
S1RX  PAD.04  [PAD.04X.04]
S1TX  PAD.04  [PAD.04X.04]
S2RX  PAD.04  [PAD.04X.04]
S2TX  PAD.04  [PAD.04X.04]
VDD_5V_BRICK  PAD.04  [PAD.04X.04]
VDD_5V_IN  PAD.04  [PAD.04X.04]
VDD_SERVO  PAD.04  [PAD.04X.04]

### Nets
GND [power]: GND..P$1 GND.P$1 ; also sheet 1,2,3,4,5,6,7
IO-BOOT0: IO-BOOT1101.P$1 ; also sheet 5
IO-CAN_RX: CAN_L.P$1 ; also sheet 2,5
IO-CAN_TX: CAN_H.P$1 ; also sheet 2,5
PRESSURE_SENS_IN: ADC_PR.P$1 ; also sheet 2
SERIAL1_RX: S1RX.P$1 ; also sheet 2
SERIAL1_TX: S1TX.P$1 ; also sheet 2
SERIAL2_RX: S2RX.P$1 ; also sheet 2
SERIAL2_TX: S2TX.P$1 ; also sheet 2
VDD_5V_BRICK [power]: VDD_5V_BRICK.P$1 ; also sheet 7
VDD_5V_IN [power]: VDD_5V_IN.P$1 ; also sheet 1,4,7
VDD_SERVO [power]: VDD_SERVO.P$1 ; also sheet 6,7

### Notes on the sheet
- Production Testing Pads
- COMMS | STATUS AND ANALOG | POWER
- Parts:
  Resistors: 0402 / 1% unless specified otherwise
  Capacitors: 0402 to 1206, ceramic, voltage rating: 10V unless specified
- Mounting holes to suit M3 fastener
- and Richco R908 series spacer.
- Use R908-5 spacers to stack with
- other PX4 series boards (7.95 mm).
- Minimum drill: 0.3 mm
- Minimum trace width (use mm for traces): 0.15 mm
- Minimum copper distance (all signals): 0.15 mm
- Dimension / hole minimum distance: 0.2 mm
- Layout grid: 4 mil, part grid: 4 mil. Dimensions / hole positions: 0.5 mm
- Board: FR4 black, 1.0 mm. Solder stop on vias < 0.6 mm.
- Signoff rules: Footprint checked,
  pinmap checked,
  schematic checked, 
  cross-references to
  other pages checked.
- Routing:
  1: general/escape
  2: ground
  3: horizontal
  4: vertical
  5: power
  6: general/escape
- Test and Fiducials
- Fiducials for machine
  vision alignment.

## Library data of the parts
ADC_PR CAN_H CAN_L GND GND. IO-BOOT1101 S1RX S1TX S2RX S2TX VDD_5V_BRICK VDD_5V_IN VDD_SERVO = pixhawk2:PAD: Test pad This footprint includes three classes: The actual test pads, a pogo-pin footprint to mount the pogo-pin as through-hole part and a hole footprint which allows the head of the pogo-pin to pass through (do NOT use the hole to mount the pogo-pin). In a typical test setup, the stack would consist of three PCBs: The actual PCB under testing with a test pad on the bottom, then a second PCB with the hole for the pogo-pin head where the PCB under testing is pressed on and a third PCB at 30 mm / 1.2" distance with the pogo-pin footprints. The pogo-pins are soldered to the last PCB. To create the stack, copy the board under testing and exchange the footprints - this way the correct positioning is ensured.; BOM: EXCLUDE; PARTNO: *
C101 C201 C202 C302 C303 C307 C308 C314 C401 C501-C504 C507 C601 C705 = pixhawk2:CAP: Capacitor Standard 0603 ceramic capacitor, and 0.1" leaded capacitor.; PARTNO: CC0402ZRY5V7BB104
C301 C306 C309 C311 = pixhawk2:CAP: Capacitor Standard 0603 ceramic capacitor, and 0.1" leaded capacitor.; PARTNO: CC0805ZKY5V6BB106
C304 C305 C702 = pixhawk2:CAP: Capacitor Standard 0603 ceramic capacitor, and 0.1" leaded capacitor.; PARTNO: CC0402KRX7R7BB103
C310 C404 = pixhawk2:CAP: Capacitor Standard 0603 ceramic capacitor, and 0.1" leaded capacitor.; PARTNO: C1005X5R1C474K050BC
C312 C313 = pixhawk2:CAP: Capacitor Standard 0603 ceramic capacitor, and 0.1" leaded capacitor.; PARTNO: C1608X6S1C225K080AC
C315 = pixhawk2:CAP: Capacitor Standard 0603 ceramic capacitor, and 0.1" leaded capacitor.; PARTNO: 06033C103JAT2A
C402 C703 C706 = pixhawk2:CAP: Capacitor Standard 0603 ceramic capacitor, and 0.1" leaded capacitor.; PARTNO: CC0603ZRY5V7BB105
C403 = pixhawk2:CAP: Capacitor Standard 0603 ceramic capacitor, and 0.1" leaded capacitor.; PARTNO: C0402C562K5RACTU
C505 C506 = pixhawk2:CAP: Capacitor Standard 0603 ceramic capacitor, and 0.1" leaded capacitor.; PARTNO: C1005C0G1H080C
C701 = pixhawk2:CAP: Capacitor Standard 0603 ceramic capacitor, and 0.1" leaded capacitor.; PARTNO: CL21A106KAYNNNE
C704 C707 = pixhawk2:CAP: Capacitor Standard 0603 ceramic capacitor, and 0.1" leaded capacitor.; PARTNO: C1608X5R1A106K080AC
D201-D204 D401 D501 D601 D602 D703 D704 = pixhawk2:DIODE-TVS; PARTNO: PESD0402-140
D701 D702 = pixhawk2:PMEG2005CT: 500 mA low VF dual MEGA Schottky barrier rectifier http://www.nxp.com/documents/data_sheet/PMEG2005CT.pdf; PARTNO: PMEG2005CT
F701 F702 = pixhawk2:PTC: Resettable Fuse PTC Resettable Fuse. Spark Fun Electronics SKU : COM-08357; PARTNO: 0ZCA0035FF2G
J201 J202 J701 = con-hirose-df13:DF13-6P-1.25: DF13-6P 1.25mm Pitch Miniature Crimping Connector.; PARTNO: DF13C-6P-1.25V(20)
J203 = con-hirose-df13:DF13-5P-1.25: DF13-5P 1.25mm Pitch Miniature Crimping Connector.; PARTNO: DF13C-5P-1.25V(20)
J204 J402 = con-hirose-df13:DF13-3P-1.25: DF13-3P 1.25mm Pitch Miniature Crimping Connector.; PARTNO: DF13C-3P-1.25V(20)
J205 = con-hirose-df13:DF13-4P-1.25: DF13-4P 1.25mm Pitch Miniature Crimping Connector.; PARTNO: DF13C-4P-1.25V(20)
J401 = con-hirose-df13:DF13-2P-1.25: DF13-2P 1.25mm Pitch Miniature Crimping Connector.; PARTNO: DF13C-2P-1.25V(20)
J501 = for-transfers:JST-ZH-3; PARTNO: B3B-ZR-SM4-TF (LF)(SN)(P)
J601 = pixhawk2:HEADER-3X10
JP1 JP2 = pixhawk2:FIDUCIAL: Fiducial Alignment Points Various fiducial points for machine vision alignment.; BOM: EXCLUDE; PARTNO: *
JX501 = pixhawk2:HEADER-3X1: Single row 0.1" servo header; BOM: EXCLUDE
JX502 = pixhawk2:ARM_MINI_JTAG: CONNECTOR wire to board 1.25 mm (.049 inch) pitch header; BOM: EXCLUDE; PARTNO: M50-3900542
L201-L204 L701 L702 = pixhawk2:KNH16C104DA5TS: Kyocera KNH16C104DA5TS EMI filter; PARTNO: KNH16C104DA5TS
L401 = pixhawk2:INDUCTOR: Inductors Basic Inductor/Choke - 0603 and 1210. Footprints are not proven and vary greatly between part numbers. SRR1210: Bourns SRR1210 parts, e.g. SRR1210-100M; PARTNO: MLZ2012M470W
LED401 = pixhawk2:LED: LEDs Standard schematic elements and footprints for 5mm, 3mm, 1206, and 0603 sized LEDs. 5mm - Spark Fun Electronics SKU : COM-00529 (and others); PARTNO: APTD1608CGCK
LED402 = pixhawk2:LED: LEDs Standard schematic elements and footprints for 5mm, 3mm, 1206, and 0603 sized LEDs. 5mm - Spark Fun Electronics SKU : COM-00529 (and others); PARTNO: APTD1608SECK
LED403 = pixhawk2:LED: LEDs Standard schematic elements and footprints for 5mm, 3mm, 1206, and 0603 sized LEDs. 5mm - Spark Fun Electronics SKU : COM-00529 (and others); PARTNO: APTD1608QBC/D
M3_MOUNT1101-M3_MOUNT1104 = pixhawk2:MOUNT-HOLE; BOM: EXCLUDE; PARTNO: *
OSHW_LOGO = pixhawk2:OSHW-LOGO: Open Source Hardware Logo This logo indicates the piece of hardware it is found on incorporates a OSHW license and/or adheres to the definition of open source hardware found here: http://freedomdefined.org/OSHW; BOM: EXCLUDE; PARTNO: *
R201-R206 R211 R212 = pixhawk2:RESISTOR: Resistor Basic schematic elements and footprints for 0603, 1206, and PTH 1/10th watt (small) resistors.; PARTNO: RC0402FR-07120RL
R207-R210 R604-R606 R701 R702 R705 R706 = pixhawk2:RESISTOR: Resistor Basic schematic elements and footprints for 0603, 1206, and PTH 1/10th watt (small) resistors.; PARTNO: ERA-2AEB103X
R401 = pixhawk2:RESISTOR: Resistor Basic schematic elements and footprints for 0603, 1206, and PTH 1/10th watt (small) resistors.; PARTNO: RMCF0402FT9K09
R402 R404 R501 R502 R601 = pixhawk2:RESISTOR: Resistor Basic schematic elements and footprints for 0603, 1206, and PTH 1/10th watt (small) resistors.; PARTNO: RC0402FR-0710KL
R403 = pixhawk2:RESISTOR: Resistor Basic schematic elements and footprints for 0603, 1206, and PTH 1/10th watt (small) resistors.; PARTNO: RC0402FR-07100KL
R405 = pixhawk2:RESISTOR: Resistor Basic schematic elements and footprints for 0603, 1206, and PTH 1/10th watt (small) resistors.; PARTNO: RMCF0402FT453K
R406 = pixhawk2:RESISTOR: Resistor Basic schematic elements and footprints for 0603, 1206, and PTH 1/10th watt (small) resistors.; PARTNO: RMCF0402FT16K5
R407-R410 R602 R603 = pixhawk2:RESISTOR: Resistor Basic schematic elements and footprints for 0603, 1206, and PTH 1/10th watt (small) resistors.; PARTNO: RC0402FR-07220RL
R411 = pixhawk2:RESISTOR: Resistor Basic schematic elements and footprints for 0603, 1206, and PTH 1/10th watt (small) resistors.; PARTNO: ERJ-2GEJ680X
R412 = pixhawk2:RESISTOR: Resistor Basic schematic elements and footprints for 0603, 1206, and PTH 1/10th watt (small) resistors.; PARTNO: RC0402FR-071K5L
R703 R704 = pixhawk2:RESISTOR: Resistor Basic schematic elements and footprints for 0603, 1206, and PTH 1/10th watt (small) resistors.; PARTNO: RC0402FR-071ML
S501 = pixhawk2:SWITCH-MOMENTARY-2; PARTNO: EVQ-P7J01P
U101 = e14_Rpi2_RevA:RPI2: Device for Raspberry Pi 2 board created by www.element14.com More information and support community is available at http://www.element14.com/community/community/raspberry-pi/raspberrypi2
U102 = pixhawk2:FM25V01: FM25V01 128Kb Serial 3V F-RAM Memory; DATASHEET: http://www.ramtron.com/files/datasheets/FM25V01_ds.pdf; LINK: http://www.digikey.com/product-detail/en/FM25V01-GTR/1140-1026-1-ND/2809832; MFGPN: FM25V01; PARTNO: FM25V01-G
U201 = pixhawk2:TXS0108; PARTNO: TXS0108ERGYR
U301 = pixhawk2:L3G4200DH: L3G4200DH - Digital 3-axis Gyroscope The L3G4200DH is a low-power three-axis angular rate sensor. The L3G4200DH has a full scale of ±250/±500/ ±2000 dps and is capable of measuring rates with a user-selectable bandwidth. It can operate within a temperature range from -40 °C to +85 °C. Supply voltage: 2.4 V to 3.6 V. Full datasheet: L3G4200DH Datasheet <http://www.st.com/stonline/products/literature/ds/17300.pdf>; PARTNO: L3GD20
U302 = pixhawk2:L3GD20H: L3GD20H MEMS motion sensor: 3-axis digital output gyroscope; BOM: EXCLUDE; DATASHEET: http://www.st.com/internet/com/TECHNICAL_RESOURCES/TECHNICAL_LITERATURE/DATASHEET/DM00060659.pdf; LINK: http://www.st.com/internet/analog/product/254039.jsp; MFGPN: L3GD20H; PARTNO: L3GD20H
U304 = pixhawk2:LSM303D: LSM303D Ultra compact high performance e-compass: 3D accelerometer and 3D magnetometer module; DATASHEET: http://www.st.com/internet/com/TECHNICAL_RESOURCES/TECHNICAL_LITERATURE/DATASHEET/DM00057547.pdf; LINK: http://www.st.com/internet/analog/product/253884.jsp; MFGPN: LSM303D; PARTNO: LSM303D
U305 = pixhawk2:MPU-6000: Invensense MPU-6000: 3-axis gyro, 3-axis accel & 9-axis MotionFusion The MPU-60X0 Motion Processing Unit (MPU?) is the world?s first motion processing solution with integrated 9-axis sensor fusion for handset and tablet applications, game controllers, motion pointer remote controls, and other consumer devices. The MPU-60X0 has an embedded 3-axis MEMS gyroscope, 3-axis MEMS accelerometer and Digital Motion Processor? (DMP) hardware accelerator engine with an auxiliary I 2 C port that interfaces to third party digital sensors, such as magnetometers. Interfacing with a 3-axis magnetometer delivers a complete 9-axis sensor fusion output to the MPU?s primary I 2 C or SPI port. (SPI is available on MPU-6000 only). This combines acceleration and rotational motion plus heading information into a single data stream for the application; DATASHEET: http://invensense.com/mems/gyro/documents/PS-MPU-6000A-00_v1.0.pdf; LINK: http://invensense.com/mems/gyro/mpu6000.html; MFGPN: MPU-6000; PARTNO: MPU-6000
U306 = pixhawk2:MS5611-01BA: MS5611-01BA The MS5611-01BA is a new generation of high resolution altimeter sensors from MEAS Switzerland with SPI and I 2 C bus interface. It is optimized for altimeters and variometers with an altitude resolution of 10 cm. The sensor module includes a high linearity pressure sensor and an ultra low power 24 bit ?? ADC with internal factory calibrated coefficients. It provides a precise digital 24 Bit pressure and temperature value and different operation modes that allow the user to optimize for conversion speed and current consumption. A high resolution temperature output allows the implementation of an altimeter/thermometer function without any additional sensor. The MS5611-01BA can be interfaced to virtually any microcontroller. The communication protocol is simple, without the need of programming internal registers in the device. Small dimensions of only 5.0 mm x 3.0 mm and a height of 1.7 mm allow for integration in mobile devices. This new sensor module generation is based on leading MEMS technology and latest benefits from MEAS Switzerland proven experience and know-how in high volume manufacturing of altimeter modules, which have been widely used for over a decade. The sensing principle employed leads to very low hysteresis and high stability of both pressure and temperature signal. High resolution module, 10 cm Fast conversion down to 1 ms Low power, 1 µA (standby < 0.15 µA) QFN package 5.0 x 3.0 x 1.7 mm3 Supply voltage 1.8 to 3.6 V Integrated digital pressure sensor (24 bit ?? ADC) Operating range: 10 to 1200 mbar, -40 to +85 °C I2C and SPI interface up to 20 MHz No external components (Internal oscillator) Excellent long term stability; DATASHEET: http://www.meas-spec.com/downloads/MS5611-01BA01.pdf; LINK: http://www.meas-spec.com/product/t_product.aspx?id=8503#; MFGPN: MS5611-01BA; PARTNO: MS5611-01BA
U401 = pixhawk2:TCA62724FMG: Toshiba TCA62724FMG I2C RGB LED driver; PARTNO: TCA62724FMG
U402 = pixhawk2:LT3469: LT3469 Piezo microactuator driver with boost regulator; PARTNO: LT3469ETS8
U403 = pixhawk2:RGB-LED: RGB LED with separate anode/cathode terminals; PARTNO: LRTB GFTG-T7AW-1+V7A7-29+R5T9-49-L
U501 = pixhawk2:STM32F10XRXT6: ST STM32F101/103/105 64pin LQFP
U601 = pixhawk2:74LVC2G240: Dual inverter tri-state, 3.3V/5V compatible http://www.nxp.com/documents/data_sheet/74LVC2G240.pdf http://focus.ti.com/lit/ds/symlink/sn74lvc2g240.pdf; PARTNO: 74LVC2G240DP,125
U701 = pixhawk2:MIC5332; PARTNO: MIC5332-SSYMT
X501 = pixhawk2:OSCILLATOR: Crystal Oscillator in 3.2x2.5 SMD; PARTNO: NX3225SA-24.000000MHZ

## Net classes
0 signal: width 0.15 mm, drill 0.15 mm, clearance 0.152 mm
1 power: width 0.15 mm, drill 0.2 mm, clearance 0.152 mm